# EAGLE design MM8I Mk2 (EAGLE 9.5.2)

## Sheet 1 of 3
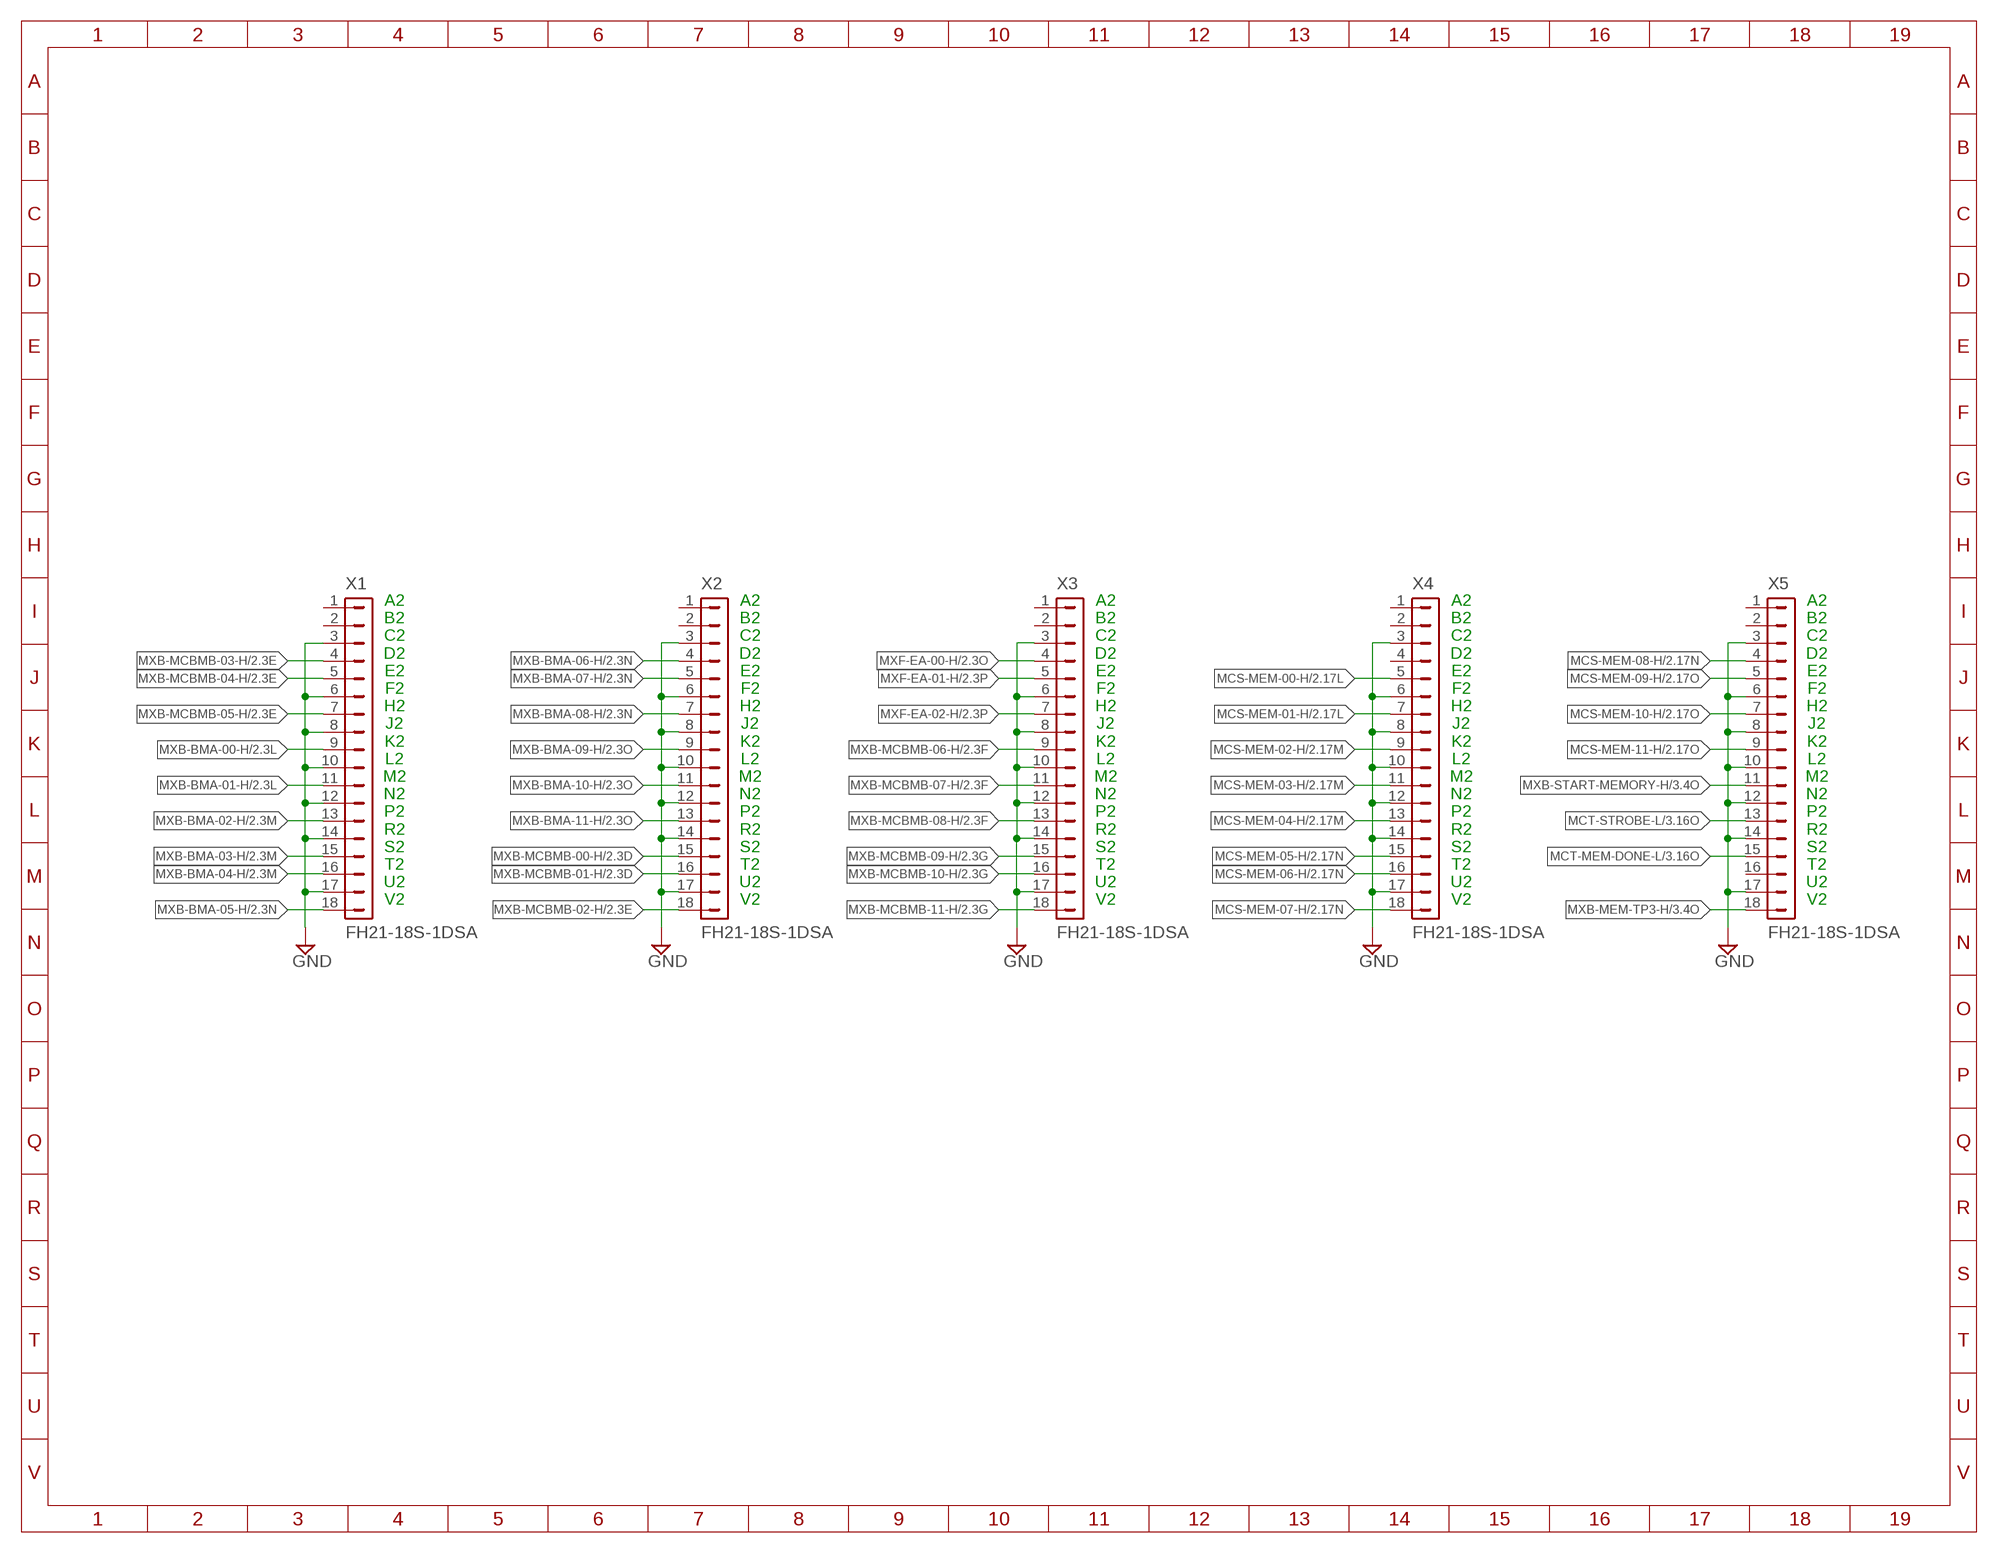
[diagram p0: schematic, sheet 1]

### Parts
X1  FH21-18S-1DSA  [FH21-18S-1DSA]
X2  FH21-18S-1DSA  [FH21-18S-1DSA]
X3  FH21-18S-1DSA  [FH21-18S-1DSA]
X4  FH21-18S-1DSA  [FH21-18S-1DSA]
X5  FH21-18S-1DSA  [FH21-18S-1DSA]

### Nets
GND: X1.3 X1.6 X1.8 X1.10 X1.12 X1.14 X1.17 X2.3 X2.6 X2.8 X2.10 X2.12 X2.14 X2.17 X3.3 X3.6 X3.8 X3.10 X3.12 X3.14 X3.17 X4.3 X4.6 X4.8 X4.10 X4.12 X4.14 X4.17 X5.3 X5.6 X5.8 X5.10 X5.12 X5.14 X5.17 ; also sheet 2,3
MCS-MEM-00-H: X4.5 ; also sheet 2
MCS-MEM-01-H: X4.7 ; also sheet 2
MCS-MEM-02-H: X4.9 ; also sheet 2
MCS-MEM-03-H: X4.11 ; also sheet 2
MCS-MEM-04-H: X4.13 ; also sheet 2
MCS-MEM-05-H: X4.15 ; also sheet 2
MCS-MEM-06-H: X4.16 ; also sheet 2
MCS-MEM-07-H: X4.18 ; also sheet 2
MCS-MEM-08-H: X5.4 ; also sheet 2
MCS-MEM-09-H: X5.5 ; also sheet 2
MCS-MEM-10-H: X5.7 ; also sheet 2
MCS-MEM-11-H: X5.9 ; also sheet 2
MCT-MEM-DONE-L: X5.15 ; also sheet 3
MCT-STROBE-L: X5.13 ; also sheet 3
MXB-BMA-00-H: X1.9 ; also sheet 2
MXB-BMA-01-H: X1.11 ; also sheet 2
MXB-BMA-02-H: X1.13 ; also sheet 2
MXB-BMA-03-H: X1.15 ; also sheet 2
MXB-BMA-04-H: X1.16 ; also sheet 2
MXB-BMA-05-H: X1.18 ; also sheet 2
MXB-BMA-06-H: X2.4 ; also sheet 2
MXB-BMA-07-H: X2.5 ; also sheet 2
MXB-BMA-08-H: X2.7 ; also sheet 2
MXB-BMA-09-H: X2.9 ; also sheet 2
MXB-BMA-10-H: X2.11 ; also sheet 2
MXB-BMA-11-H: X2.13 ; also sheet 2
MXB-MCBMB-00-H: X2.15 ; also sheet 2
MXB-MCBMB-01-H: X2.16 ; also sheet 2
MXB-MCBMB-02-H: X2.18 ; also sheet 2
MXB-MCBMB-03-H: X1.4 ; also sheet 2
MXB-MCBMB-04-H: X1.5 ; also sheet 2
MXB-MCBMB-05-H: X1.7 ; also sheet 2
MXB-MCBMB-06-H: X3.9 ; also sheet 2
MXB-MCBMB-07-H: X3.11 ; also sheet 2
MXB-MCBMB-08-H: X3.13 ; also sheet 2
MXB-MCBMB-09-H: X3.15 ; also sheet 2
MXB-MCBMB-10-H: X3.16 ; also sheet 2
MXB-MCBMB-11-H: X3.18 ; also sheet 2
MXB-MEM-TP3-H: X5.18 ; also sheet 3
MXB-START-MEMORY-H: X5.11 ; also sheet 3
MXF-EA-00-H: X3.4 ; also sheet 2
MXF-EA-01-H: X3.5 ; also sheet 2
MXF-EA-02-H: X3.7 ; also sheet 2
Unconnected: X1.1 X1.2 X2.1 X2.2 X3.1 X3.2 X4.1 X4.2 X4.4 X5.1 X5.2 X5.16

### Notes on the sheet
- A2
  B2
  C2
  D2
  E2
  F2
  H2
  J2
  K2
  L2
  M2
  N2
  P2
  R2
  S2
  T2
  U2
  V2
- A2
  B2
  C2
  D2
  E2
  F2
  H2
  J2
  K2
  L2
  M2
  N2
  P2
  R2
  S2
  T2
  U2
  V2
- A2
  B2
  C2
  D2
  E2
  F2
  H2
  J2
  K2
  L2
  M2
  N2
  P2
  R2
  S2
  T2
  U2
  V2
- A2
  B2
  C2
  D2
  E2
  F2
  H2
  J2
  K2
  L2
  M2
  N2
  P2
  R2
  S2
  T2
  U2
  V2
- A2
  B2
  C2
  D2
  E2
  F2
  H2
  J2
  K2
  L2
  M2
  N2
  P2
  R2
  S2
  T2
  U2
  V2

## Sheet 2 of 3
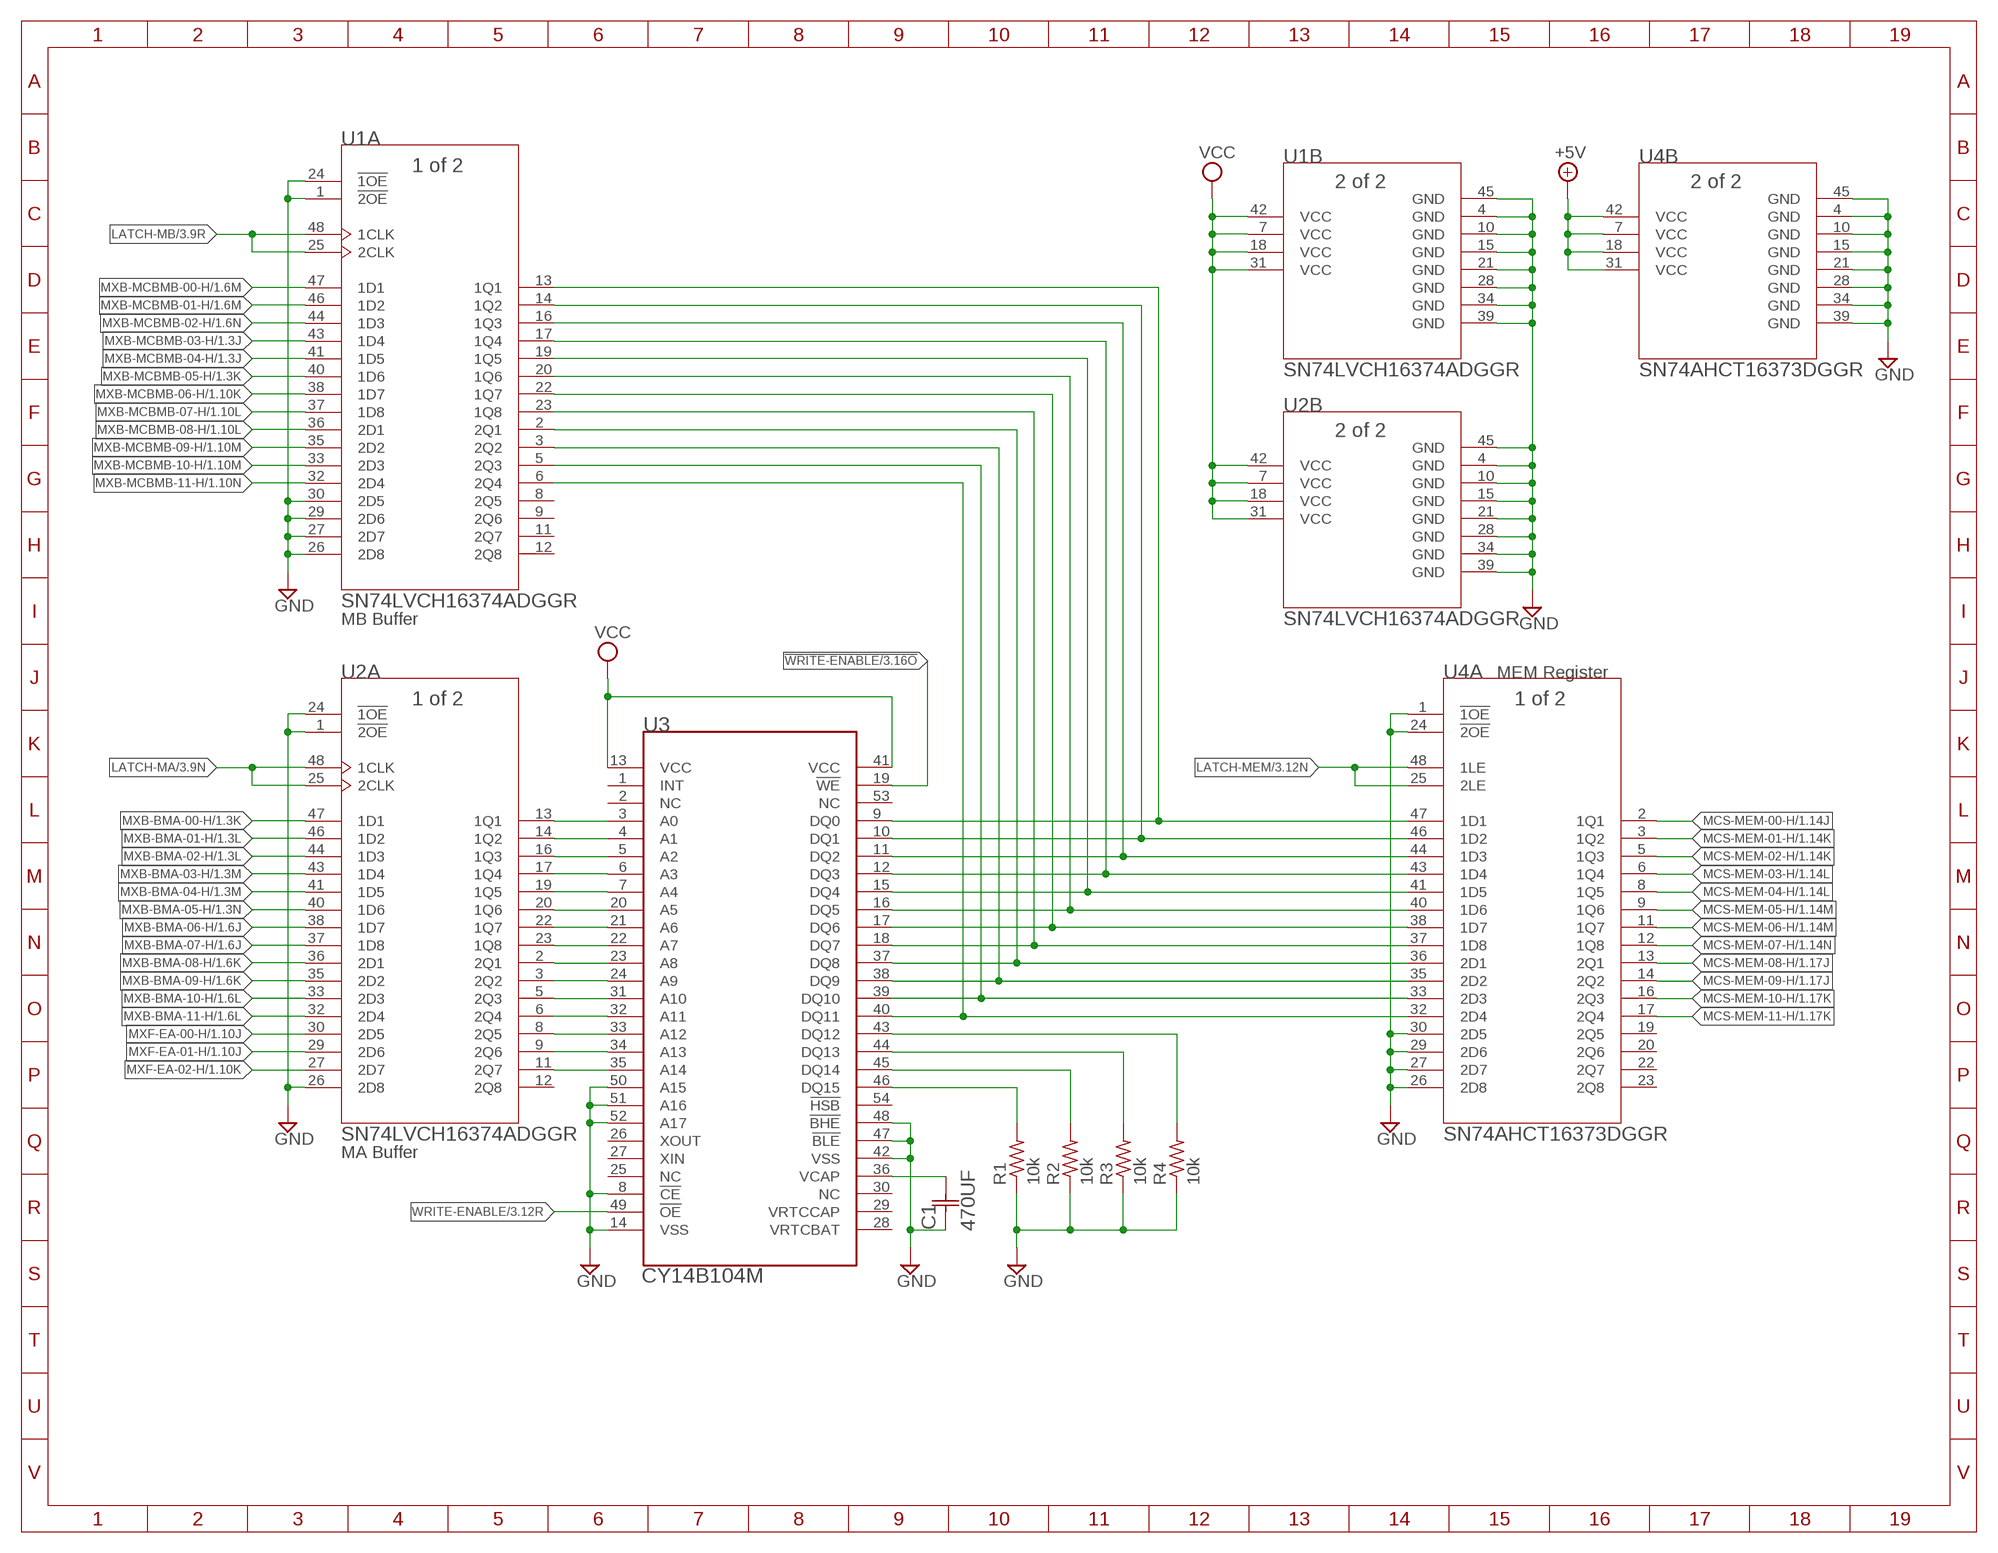
[diagram p1: schematic, sheet 2]

### Parts
C1  470UF  NOSE477M004R0100  [CAPCP7343X430N]
R1  10k  R-US_R1206  [R1206]
R2  10k  R-US_R1206  [R1206]
R3  10k  R-US_R1206  [R1206]
R4  10k  R-US_R1206  [R1206]
U1  SN74LVCH16374ADGGR  [DGG48]
U2  SN74LVCH16374ADGGR  [DGG48]
U3  CY14B104M  [TSOPII-54]
U4  SN74AHCT16373DGGR  [DGG48]

### Nets
!WRITE-ENABLE: U3.19(!WE) ; also sheet 3
+5V: U4.7(B:VCC) U4.18(B:VCC) U4.31(B:VCC) U4.42(B:VCC) ; also sheet 3
GND: C1.2(C2) R1.1 R2.1 R3.1 R4.1 U1.1(A:!2OE) U1.4(B:GND) U1.10(B:GND) U1.15(B:GND) U1.21(B:GND) U1.24(A:!1OE) U1.26(A:2D8) U1.27(A:2D7) U1.28(B:GND) U1.29(A:2D6) U1.30(A:2D5) U1.34(B:GND) U1.39(B:GND) U1.45(B:GND) U2.1(A:!2OE) U2.4(B:GND) U2.10(B:GND) U2.15(B:GND) U2.21(B:GND) U2.24(A:!1OE) U2.26(A:2D8) U2.28(B:GND) U2.34(B:GND) U2.39(B:GND) U2.45(B:GND) U3.8(!CE) U3.14(VSS) U3.42(VSS) U3.47(!BLE) U3.48(!BHE) U3.50(A15) U3.51(A16) U3.52(A17) U4.1(A:!1OE) U4.4(B:GND) U4.10(B:GND) U4.15(B:GND) U4.21(B:GND) U4.24(A:!2OE) U4.26(A:2D8) U4.27(A:2D7) U4.28(B:GND) U4.29(A:2D6) U4.30(A:2D5) U4.34(B:GND) U4.39(B:GND) U4.45(B:GND) ; also sheet 1,3
LATCH-MA: U2.25(A:2CLK) U2.48(A:1CLK) ; also sheet 3
LATCH-MB: U1.25(A:2CLK) U1.48(A:1CLK) ; also sheet 3
LATCH-MEM: U4.25(A:2LE) U4.48(A:1LE) ; also sheet 3
MCS-MEM-00-H: U4.2(A:1Q1) ; also sheet 1
MCS-MEM-01-H: U4.3(A:1Q2) ; also sheet 1
MCS-MEM-02-H: U4.5(A:1Q3) ; also sheet 1
MCS-MEM-03-H: U4.6(A:1Q4) ; also sheet 1
MCS-MEM-04-H: U4.8(A:1Q5) ; also sheet 1
MCS-MEM-05-H: U4.9(A:1Q6) ; also sheet 1
MCS-MEM-06-H: U4.11(A:1Q7) ; also sheet 1
MCS-MEM-07-H: U4.12(A:1Q8) ; also sheet 1
MCS-MEM-08-H: U4.13(A:2Q1) ; also sheet 1
MCS-MEM-09-H: U4.14(A:2Q2) ; also sheet 1
MCS-MEM-10-H: U4.16(A:2Q3) ; also sheet 1
MCS-MEM-11-H: U4.17(A:2Q4) ; also sheet 1
MXB-BMA-00-H: U2.47(A:1D1) ; also sheet 1
MXB-BMA-01-H: U2.46(A:1D2) ; also sheet 1
MXB-BMA-02-H: U2.44(A:1D3) ; also sheet 1
MXB-BMA-03-H: U2.43(A:1D4) ; also sheet 1
MXB-BMA-04-H: U2.41(A:1D5) ; also sheet 1
MXB-BMA-05-H: U2.40(A:1D6) ; also sheet 1
MXB-BMA-06-H: U2.38(A:1D7) ; also sheet 1
MXB-BMA-07-H: U2.37(A:1D8) ; also sheet 1
MXB-BMA-08-H: U2.36(A:2D1) ; also sheet 1
MXB-BMA-09-H: U2.35(A:2D2) ; also sheet 1
MXB-BMA-10-H: U2.33(A:2D3) ; also sheet 1
MXB-BMA-11-H: U2.32(A:2D4) ; also sheet 1
MXB-MCBMB-00-H: U1.47(A:1D1) ; also sheet 1
MXB-MCBMB-01-H: U1.46(A:1D2) ; also sheet 1
MXB-MCBMB-02-H: U1.44(A:1D3) ; also sheet 1
MXB-MCBMB-03-H: U1.43(A:1D4) ; also sheet 1
MXB-MCBMB-04-H: U1.41(A:1D5) ; also sheet 1
MXB-MCBMB-05-H: U1.40(A:1D6) ; also sheet 1
MXB-MCBMB-06-H: U1.38(A:1D7) ; also sheet 1
MXB-MCBMB-07-H: U1.37(A:1D8) ; also sheet 1
MXB-MCBMB-08-H: U1.36(A:2D1) ; also sheet 1
MXB-MCBMB-09-H: U1.35(A:2D2) ; also sheet 1
MXB-MCBMB-10-H: U1.33(A:2D3) ; also sheet 1
MXB-MCBMB-11-H: U1.32(A:2D4) ; also sheet 1
MXF-EA-00-H: U2.30(A:2D5) ; also sheet 1
MXF-EA-01-H: U2.29(A:2D6) ; also sheet 1
MXF-EA-02-H: U2.27(A:2D7) ; also sheet 1
N$1: C1.1(C1) U3.36(VCAP)
N$2: U1.13(A:1Q1) U3.9(DQ0) U4.47(A:1D1)
N$3: U1.14(A:1Q2) U3.10(DQ1) U4.46(A:1D2)
N$4: U1.16(A:1Q3) U3.11(DQ2) U4.44(A:1D3)
N$5: U1.17(A:1Q4) U3.12(DQ3) U4.43(A:1D4)
N$6: U1.19(A:1Q5) U3.15(DQ4) U4.41(A:1D5)
N$7: U1.20(A:1Q6) U3.16(DQ5) U4.40(A:1D6)
N$8: R4.2 U3.43(DQ12)
N$9: R1.2 U3.46(DQ15)
N$10: R2.2 U3.45(DQ14)
N$11: U1.22(A:1Q7) U3.17(DQ6) U4.38(A:1D7)
N$12: R3.2 U3.44(DQ13)
N$13: U1.23(A:1Q8) U3.18(DQ7) U4.37(A:1D8)
N$14: U1.2(A:2Q1) U3.37(DQ8) U4.36(A:2D1)
N$15: U1.3(A:2Q2) U3.38(DQ9) U4.35(A:2D2)
N$16: U1.5(A:2Q3) U3.39(DQ10) U4.33(A:2D3)
N$17: U1.6(A:2Q4) U3.40(DQ11) U4.32(A:2D4)
N$30: U2.2(A:2Q1) U3.23(A8)
N$31: U2.16(A:1Q3) U3.5(A2)
N$32: U2.13(A:1Q1) U3.3(A0)
N$33: U2.14(A:1Q2) U3.4(A1)
N$34: U2.17(A:1Q4) U3.6(A3)
N$36: U2.19(A:1Q5) U3.7(A4)
N$37: U2.20(A:1Q6) U3.20(A5)
N$38: U2.22(A:1Q7) U3.21(A6)
N$39: U2.23(A:1Q8) U3.22(A7)
N$40: U2.3(A:2Q2) U3.24(A9)
N$41: U2.5(A:2Q3) U3.31(A10)
N$42: U2.6(A:2Q4) U3.32(A11)
N$43: U2.8(A:2Q5) U3.33(A12)
N$44: U2.9(A:2Q6) U3.34(A13)
N$45: U2.11(A:2Q7) U3.35(A14)
VCC: U1.7(B:VCC) U1.18(B:VCC) U1.31(B:VCC) U1.42(B:VCC) U2.7(B:VCC) U2.18(B:VCC) U2.31(B:VCC) U2.42(B:VCC) U3.13(VCC) U3.41(VCC) ; also sheet 3
WRITE-ENABLE: U3.49(!OE) ; also sheet 3
Unconnected: U1.8(A:2Q5) U1.9(A:2Q6) U1.11(A:2Q7) U1.12(A:2Q8) U2.12(A:2Q8) U3.1(INT) U3.2(NC) U3.25(NC) U3.26(XOUT) U3.27(XIN) U3.28(VRTCBAT) U3.29(VRTCCAP) U3.30(NC) U3.53(NC) U3.54(!HSB) U4.19(A:2Q5) U4.20(A:2Q6) U4.22(A:2Q7) U4.23(A:2Q8)

### Notes on the sheet
- MB Buffer
- MEM Register
- MA Buffer

## Sheet 3 of 3
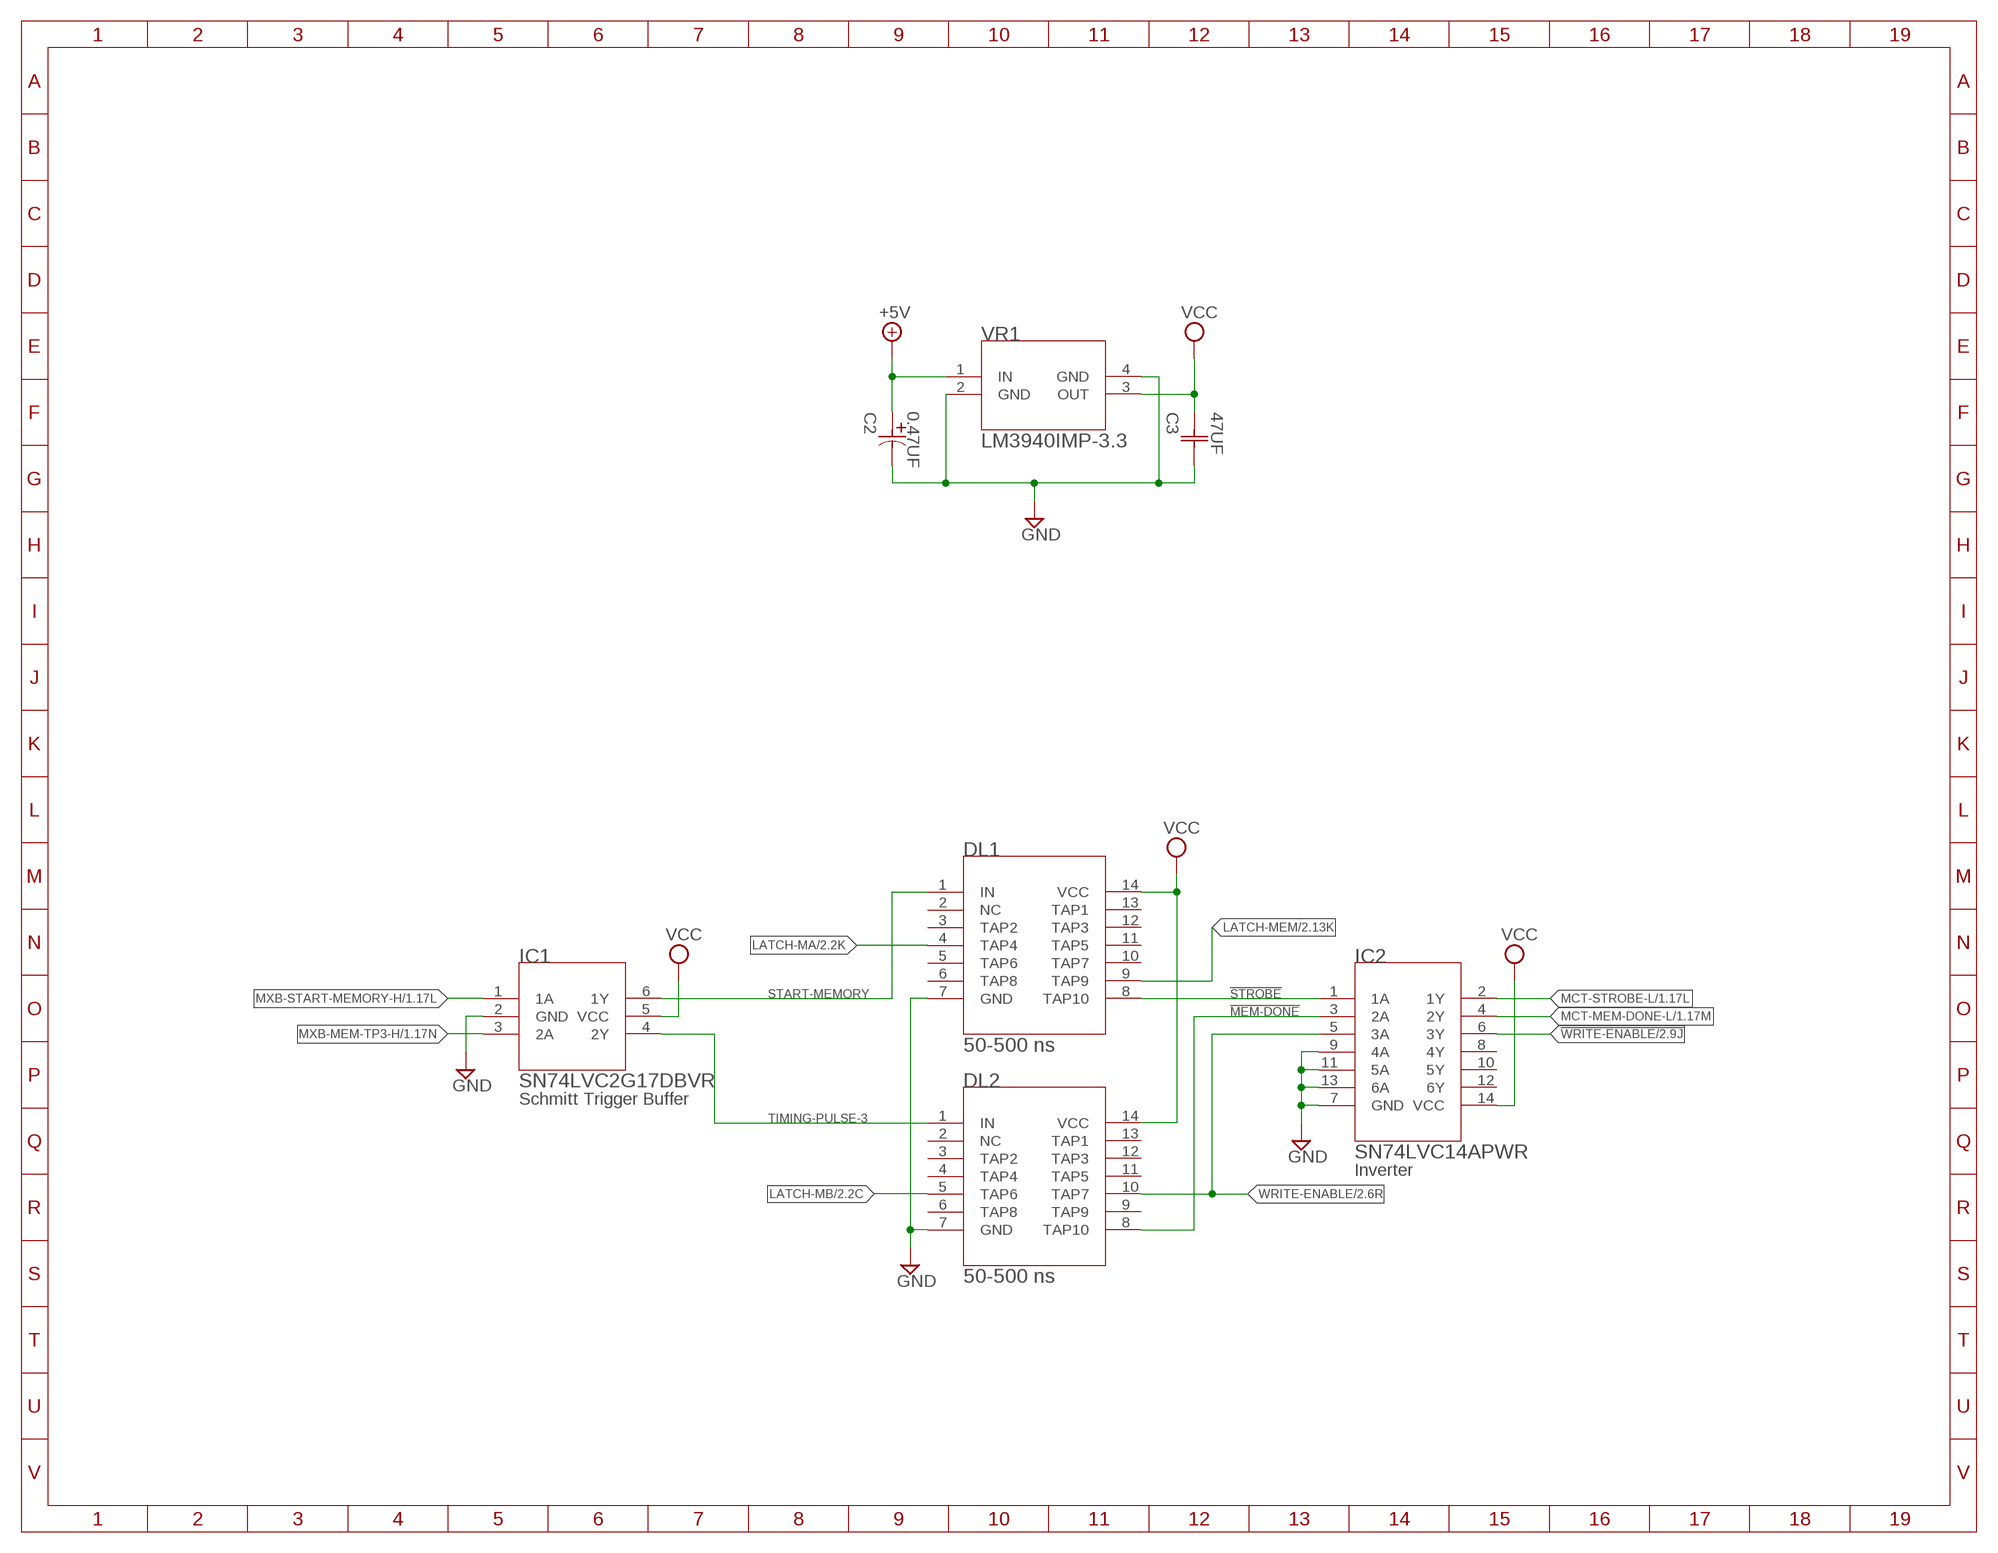
[diagram p2: schematic, sheet 3]

### Parts
C2  0.47UF  C0603C474K8PACTU  [CC0603N]
C3  47UF  NOJC476M010RWJ  [NOJC]
DL1  50-500 ns  DS1110LE-500+  [21-0066J_14]
DL2  50-500 ns  DS1110LE-500+  [21-0066J_14]
IC1  SN74LVC2G17DBVR  [DBV6]
IC2  SN74LVC14APWR  [PW14]
VR1  LM3940IMP-3.3  [MP04A]

### Nets
!MEM-DONE: DL2.8(TAP10) IC2.3(2A)
!STROBE: DL1.8(TAP10) IC2.1(1A)
!WRITE-ENABLE: IC2.6(3Y) ; also sheet 2
+5V: C2.1 VR1.1(IN) ; also sheet 2
GND: C2.2 C3.2(C2) DL1.7(GND) DL2.7(GND) IC1.2(GND) IC2.7(GND) IC2.9(4A) IC2.11(5A) IC2.13(6A) VR1.2(GND) VR1.4(GND) ; also sheet 1,2
LATCH-MA: DL1.4(TAP4) ; also sheet 2
LATCH-MB: DL2.5(TAP6) ; also sheet 2
LATCH-MEM: DL1.9(TAP9) ; also sheet 2
MCT-MEM-DONE-L: IC2.4(2Y) ; also sheet 1
MCT-STROBE-L: IC2.2(1Y) ; also sheet 1
MXB-MEM-TP3-H: IC1.3(2A) ; also sheet 1
MXB-START-MEMORY-H: IC1.1(1A) ; also sheet 1
START-MEMORY: DL1.1(IN) IC1.6(1Y)
TIMING-PULSE-3: DL2.1(IN) IC1.4(2Y)
VCC: C3.1(C1) DL1.14(VCC) DL2.14(VCC) IC1.5(VCC) IC2.14(VCC) VR1.3(OUT) ; also sheet 2
WRITE-ENABLE: DL2.10(TAP7) IC2.5(3A) ; also sheet 2
Unconnected: DL1.2(NC) DL1.3(TAP2) DL1.5(TAP6) DL1.6(TAP8) DL1.10(TAP7) DL1.11(TAP5) DL1.12(TAP3) DL1.13(TAP1) DL2.2(NC) DL2.3(TAP2) DL2.4(TAP4) DL2.6(TAP8) DL2.9(TAP9) DL2.11(TAP5) DL2.12(TAP3) DL2.13(TAP1) IC2.8(4Y) IC2.10(5Y) IC2.12(6Y)

### Notes on the sheet
- Schmitt Trigger Buffer
- Inverter

## Library data of the parts
C1 = AVX_By_element14_Batch_1:NOSE477M004R0100: CAP NIOB OXIDE , 2917; CAPACITANCETOLERANCE: ±20%; MPN: NOSE477M004R0100; OC_FARNELL: -; OC_NEWARK: 53J7410; SUPPLIER: AVX; VOLTAGERATING: 4V
C2 = MM24I:C0603C474K8PACTU: CAP, MLPC, 0603; BUILT_BY: EMA_UL_Team; MANUFACTURER_PART_NUMBER: C0603C474K8PACTU; VENDOR: Kemet
C3 = MM24I:NOJC476M010RWJ: CAP, NIOB OXIDE, 2312; BUILT_BY: EMA_UL_Team; MANUFACTURER_PART_NUMBER: NOJC476M010RWJ; VENDOR: AVX Corporation
DL1 DL2 = MM24I:DS1110LE-500+; BUILT_BY: EMA_UL_Team; MANUFACTURER_PART_NUMBER: DS1110LE-100+; VENDOR: Maxim Integrated Products
IC1 = MM24I:SN74LVC2G17DBVR; BUILT_BY: EMA_UL_Team; MANUFACTURER: Texas Instruments; MANUFACTURER_PART_NUMBER: SN74LVC2G17DBVR; VENDOR: Texas Instruments
IC2 = MM24I:SN74LVC14APWR; BUILT_BY: EMA_UL_Team; MANUFACTURER: Texas Instruments; MANUFACTURER_PART_NUMBER: SN74LVC14APWR; VENDOR: Texas Instruments
R1-R4 = rcl:R-US_: RESISTOR, American symbol; SPICEPREFIX: R
U1 U2 = MM24I:SN74LVCH16374ADGGR; BUILT_BY: EMA_UL_Team; MANUFACTURER_PART_NUMBER: SN74LVCH16374ADGGR; VENDOR: Texas Instruments
U3 = MM24I:CY14B104M: Cypress CY14B104M 4-Mbit (256 K × 16) nvSRAM with Real Time Clock https://www.cypress.com/file/43036/download
U4 = MM24I:SN74AHCT16373DGGR; BUILT_BY: EMA_UL_Team; MANUFACTURER: Texas Instruments; MANUFACTURER_PART_NUMBER: SN74AHCT16373DGGR; VENDOR: Texas Instruments
VR1 = MM24I:LM3940IMP-3.3; BUILT_BY: EMA_UL_Team; MANUFACTURER_PART_NUMBER: LM3940IMP-3.3/NOPB; VENDOR: Texas Instruments
X1-X5 = con-hirose:FH21-18S-1DSA: FPC CONNECTOR Source: con-hirose.lbr from Bob Starr <rtzaudio@mindspring.com>; OC_FARNELL: unknown; OC_NEWARK: unknown

## Board
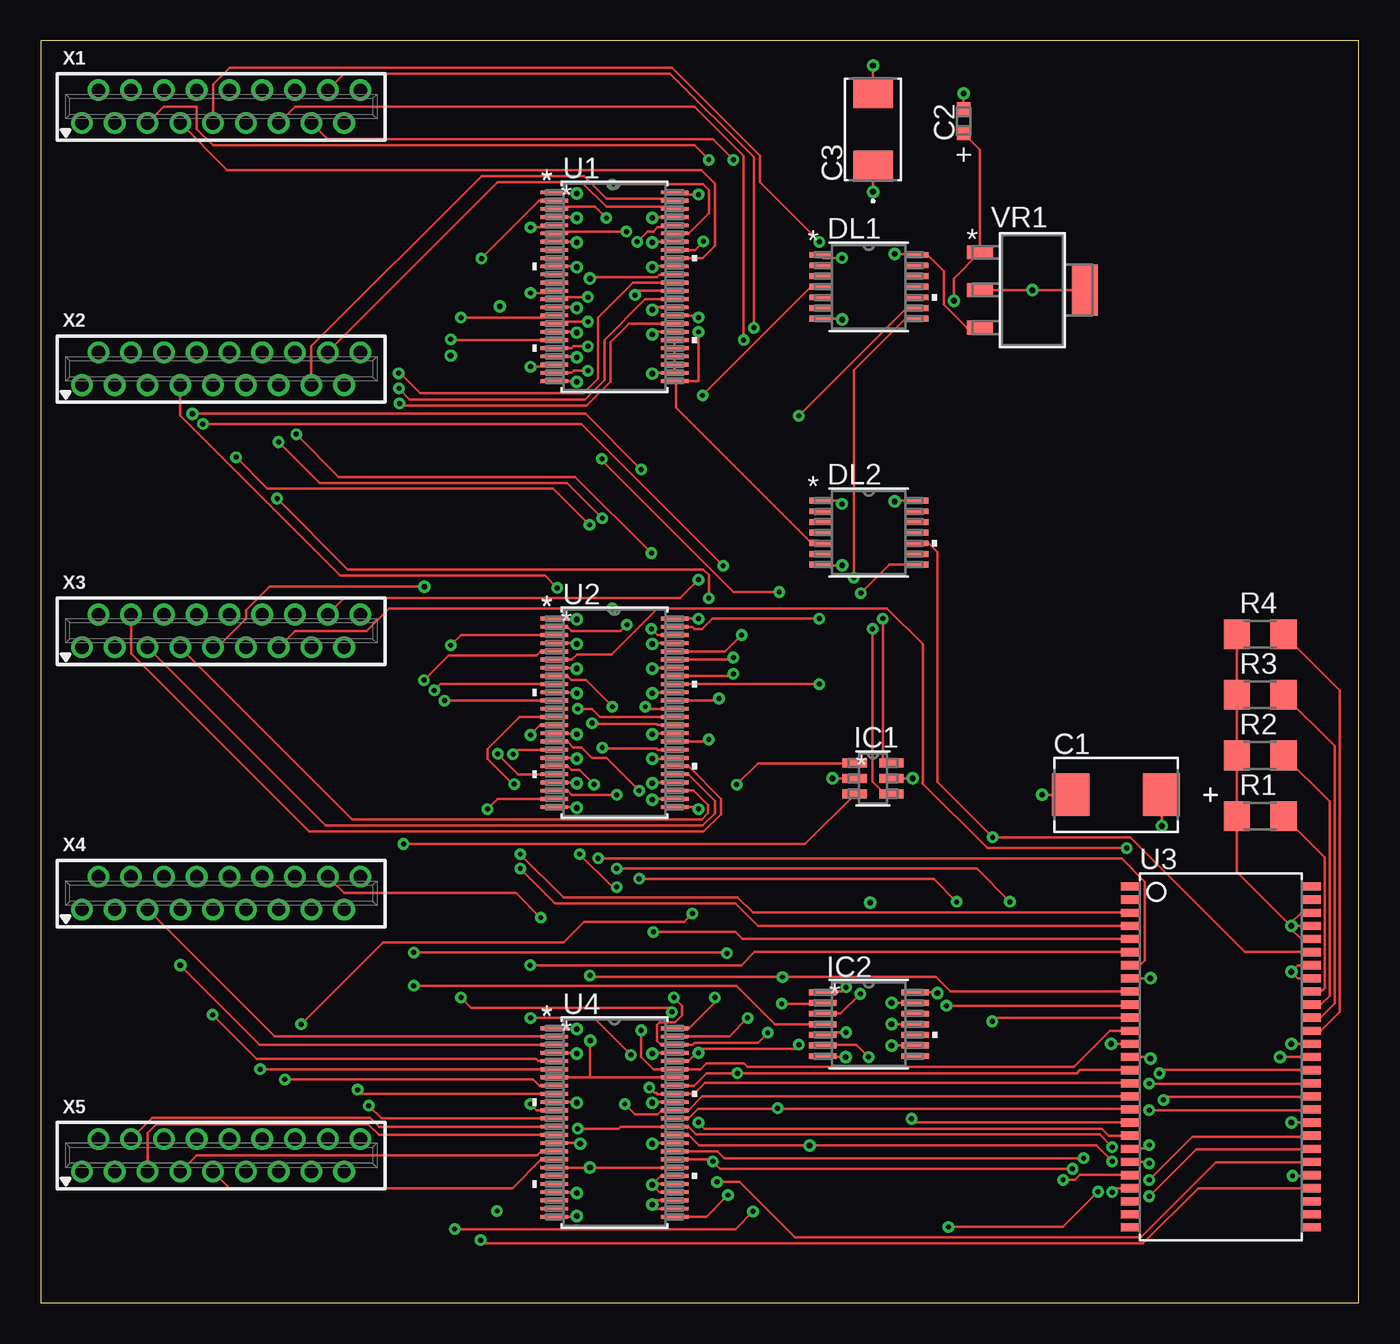
[diagram p3: board, top side]
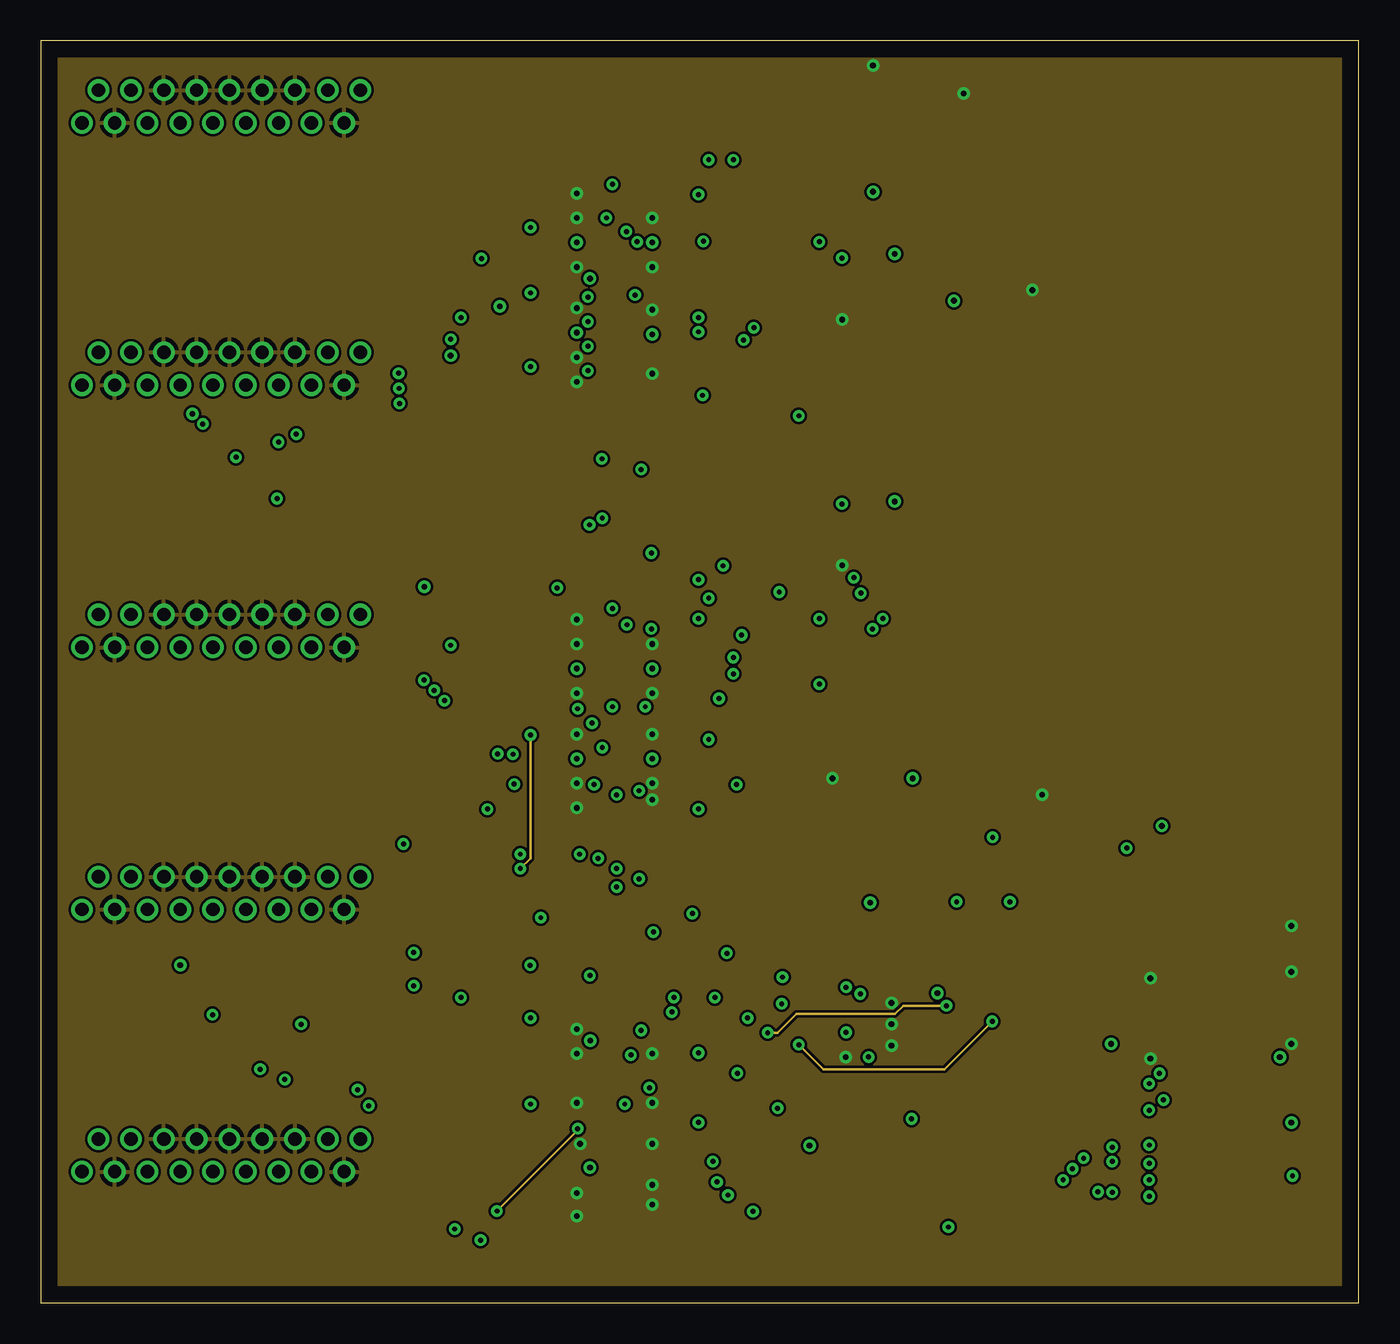
[diagram p4: board, inner layer Layer2]
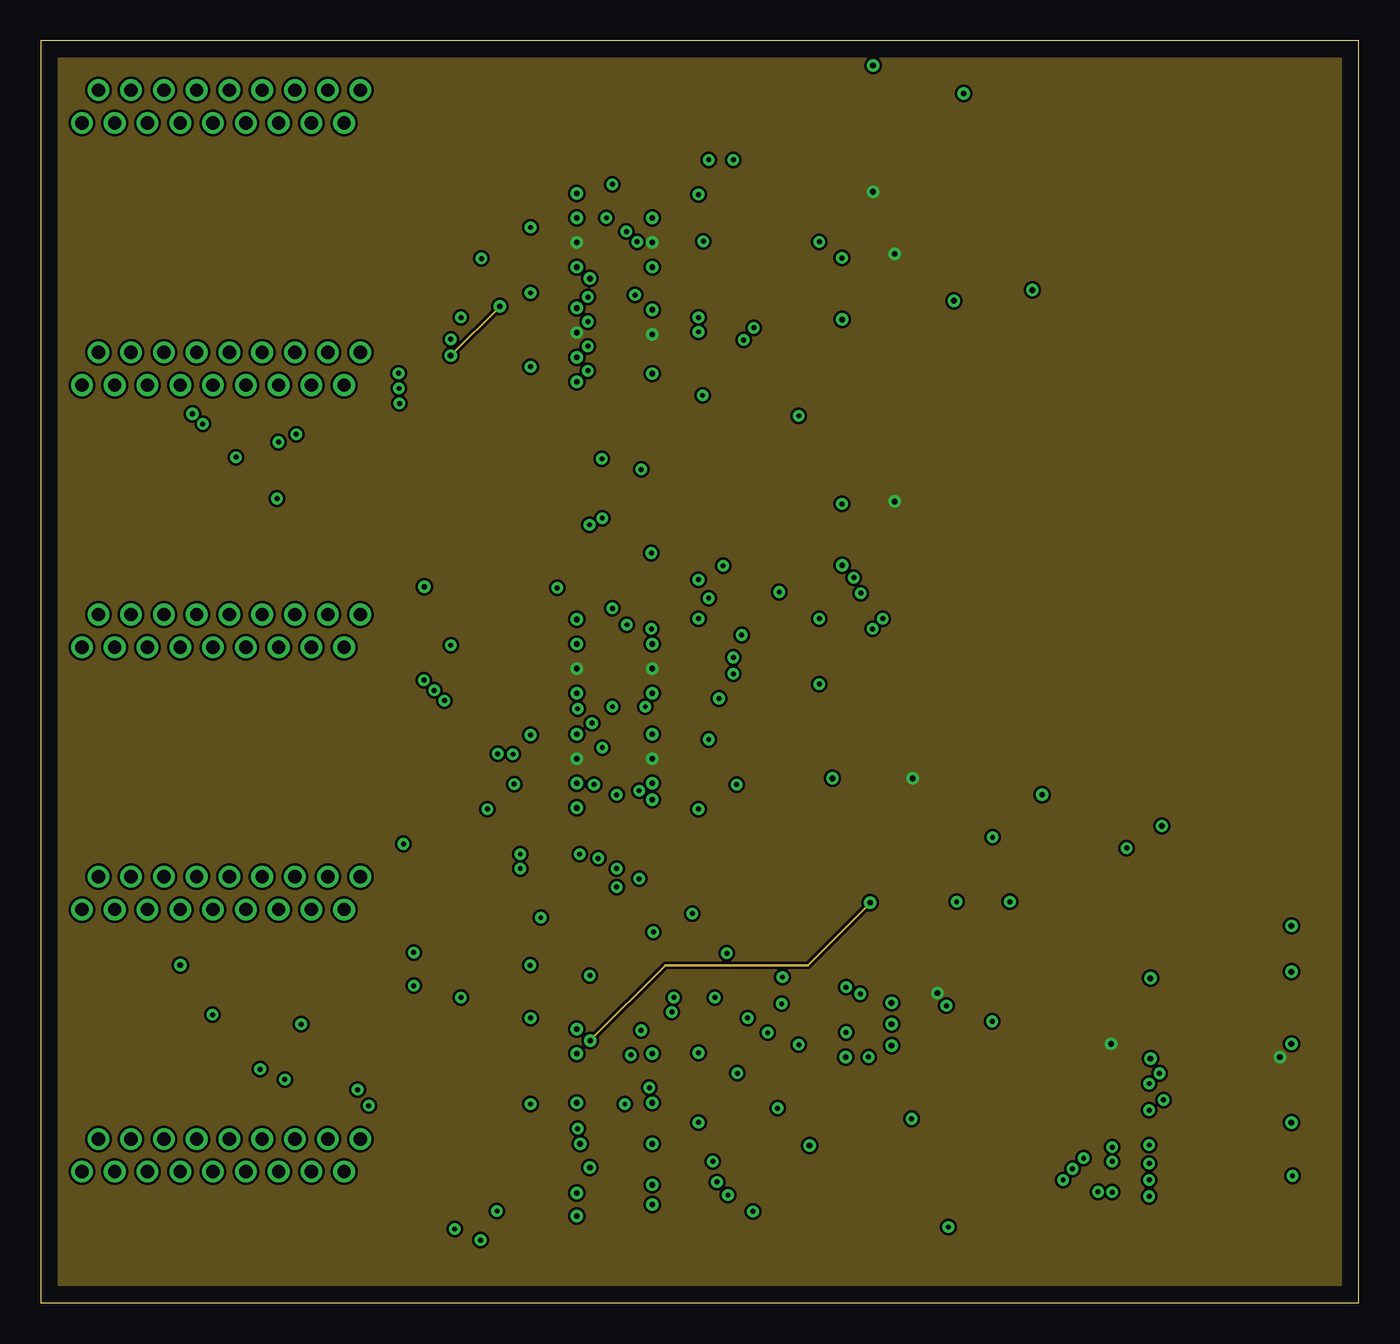
[diagram p5: board, inner layer Layer3]
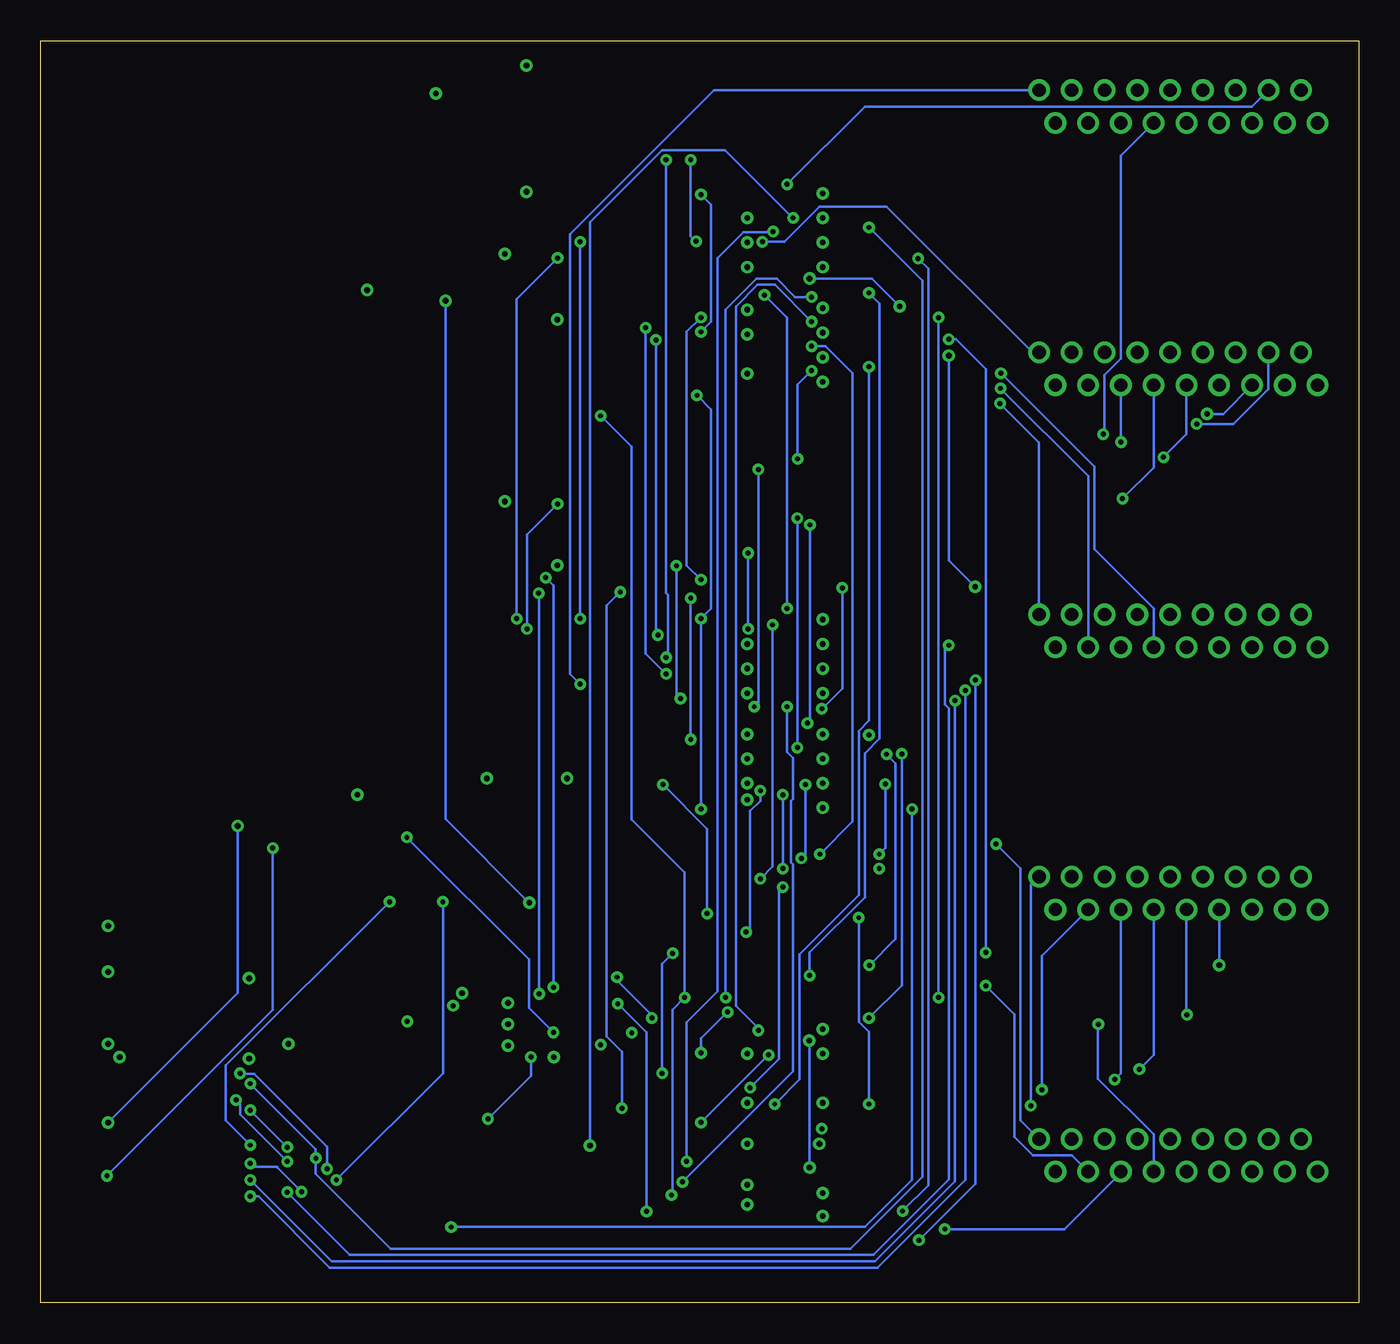
[diagram p6: board, bottom side, seen from below]

Size 80.4 x 77 mm. Coordinates in mm from the lower left corner, seen from the top.
Outline: 0,0 80.4,0 80.4,77 0,77 0,0
Copper layers (1+2*15+16): Top 0.035mm / dielectric 0.11mm / Layer2 0.035mm / dielectric 0.73mm / Layer3 0.035mm / dielectric 0.11mm / Bottom 0.035mm
Design rules "default *": minimum track width 6mil, minimum drill 0.3mm, track to track 6mil, track to pad 6mil, pad to pad 6mil, via to via 6mil, smd to smd 6mil, copper to edge 40mil, drill to drill 6mil, minimum pad ring 10mil, minimum via ring 8mil, stop-mask expansion 4mil, vias tented up to drill 0mil, thermal gap 10mil

### Footprints (pad centres in the part's own frame; a part is rotated, then mirrored left to right if it is on the bottom)
CAPCP7343X430N = smd 2.261 x 2.591: 1 -2.769,0; 2 2.769,0
CC0603N = smd 0.864 x 0.813: 1 -0.724,0; 2 0.724,0
NOJC = smd 1.88 x 2.413: 1 -2.235,0; 2 2.235,0
21-0066J_14 = smd 1.422 x 0.356: 1 -2.921,1.95; 2 -2.921,1.3; 3 -2.921,0.65; 4 -2.921,0; 5 -2.921,-0.65; 6 -2.921,-1.3; 7 -2.921,-1.95; 8 2.921,-1.95; 9 2.921,-1.3; 10 2.921,-0.65; 11 2.921,0; 12 2.921,0.65; 13 2.921,1.3; 14 2.921,1.95
DBV6 = smd 1.473 x 0.559: 1 -1.118,0.95; 2 -1.118,0; 3 -1.118,-0.95; 4 1.118,-0.95; 5 1.118,0; 6 1.118,0.95
PW14 = smd 1.676 x 0.356: 1 -2.819,1.95; 2 -2.819,1.3; 3 -2.819,0.65; 4 -2.819,0; 5 -2.819,-0.65; 6 -2.819,-1.3; 7 -2.819,-1.95; 8 2.819,-1.95; 9 2.819,-1.3; 10 2.819,-0.65; 11 2.819,0; 12 2.819,0.65; 13 2.819,1.3; 14 2.819,1.95
R1206 = smd 1.6 x 1.803: 1 -1.422,0; 2 1.422,0
DGG48 = smd 1.676 x 0.229: 1 -3.67,5.75; 2 -3.67,5.25; 3 -3.67,4.75; 4 -3.67,4.25; 5 -3.67,3.75; 6 -3.67,3.25; 7 -3.67,2.75; 8 -3.67,2.25; 9 -3.67,1.75; 10 -3.67,1.25; 11 -3.67,0.75; 12 -3.67,0.25; 13 -3.67,-0.25; 14 -3.67,-0.75; 15 -3.67,-1.25; 16 -3.67,-1.75; 17 -3.67,-2.25; 18 -3.67,-2.75; 19 -3.67,-3.25; 20 -3.67,-3.75; 21 -3.67,-4.25; 22 -3.67,-4.75; 23 -3.67,-5.25; 24 -3.67,-5.75; 25 3.67,-5.75; 26 3.67,-5.25; 27 3.67,-4.75; 28 3.67,-4.25; 29 3.67,-3.75; 30 3.67,-3.25; 31 3.67,-2.75; 32 3.67,-2.25; 33 3.67,-1.75; 34 3.67,-1.25; 35 3.67,-0.75; 36 3.67,-0.25; 37 3.67,0.25; 38 3.67,0.75; 39 3.67,1.25; 40 3.67,1.75; 41 3.67,2.25; 42 3.67,2.75; 43 3.67,3.25; 44 3.67,3.75; 45 3.67,4.25; 46 3.67,4.75; 47 3.67,5.25; 48 3.67,5.75
TSOPII-54 = smd 0.5 x 1.2: 1 -10.4,-5.502; 2 -9.6,-5.502; 3 -8.8,-5.502; 4 -8,-5.502; 5 -7.2,-5.502; 6 -6.4,-5.502; 7 -5.6,-5.502; 8 -4.8,-5.502; 9 -4,-5.502; 10 -3.2,-5.502; 11 -2.4,-5.502; 12 -1.6,-5.502; 13 -0.8,-5.502; 14 0,-5.502; 15 0.8,-5.502; 16 1.6,-5.502; 17 2.4,-5.502; 18 3.2,-5.502; 19 4,-5.502; 20 4.8,-5.502; 21 5.6,-5.502; 22 6.4,-5.502; 23 7.2,-5.502; 24 8,-5.502; 25 8.8,-5.502; 26 9.6,-5.502; 27 10.4,-5.502; 28 10.4,5.502; 29 9.6,5.502; 30 8.8,5.502; 31 8,5.502; 32 7.2,5.502; 33 6.4,5.502; 34 5.6,5.502; 35 4.8,5.502; 36 4,5.502; 37 3.2,5.502; 38 2.4,5.502; 39 1.6,5.502; 40 0.8,5.502; 41 0,5.502; 42 -0.8,5.502; 43 -1.6,5.502; 44 -2.4,5.502; 45 -3.2,5.502; 46 -4,5.502; 47 -4.8,5.502; 48 -5.6,5.502; 49 -6.4,5.502; 50 -7.2,5.502; 51 -8,5.502; 52 -8.8,5.502; 53 -9.6,5.502; 54 -10.4,5.502
MP04A = smd 1.6 x 0.838: 1 -3.2,2.3; 2 -3.2,0; 3 -3.2,-2.3 | smd 1.6 x 3.099: 4 3.2,0
FH21-18S-1DSA = drill 0.813: 1 -8.5,-1; 2 -7.5,1; 3 -6.5,-1; 4 -5.5,1; 5 -4.5,-1; 6 -3.5,1; 7 -2.5,-1; 8 -1.5,1; 9 -0.5,-1; 10 0.5,1; 11 1.5,-1; 12 2.5,1; 13 3.5,-1; 14 4.5,1; 15 5.5,-1; 16 6.5,1; 17 7.5,-1; 18 8.5,1

### Placement (x,y rotation side)
C1  65.6,31 180 top
C2  56.3,72.1 90 top
C3  50.77,71.6 90 top
DL1  50.51,62 0 top
DL2  50.51,47 0 top
IC1  50.77,32 0 top
IC2  50.51,17 0 top
R1  74.4,29.7 0 top
R2  74.4,33.4 0 top
R3  74.4,37.1 0 top
R4  74.4,40.8 0 top
U1  35,62 0 top
U2  35,36 0 top
U3  72,15 270 top
U4  35,11 0 top
VR1  60.5,61.8 0 top
X1  11,73 0 top
X2  11,57 0 top
X3  11,41 0 top
X4  11,25 0 top
X5  11,9 0 top

### Tracks (layer width: path | path; a pad name or v marks a point on that pad's centre or on a via)
!MEM-DONE  (via drill 0.3)
  Top 0.152: v50,18.85 48.8,17.65 IC2.3 | DL2.8 51.77,45.05 v50.02,43.3
  Bottom 0.152: v50.02,43.3 50,43.27 v50,18.85
!STROBE  (via drill 0.3)
  Top 0.152: v49.12,19.25 48.88,19 47.75,19 IC2.1 | DL1.8 52.75,60.05 49.6,56.9 v49.6,44.25
  Bottom 0.152: v49.6,44.25 49.12,43.77 v49.12,19.25
!WRITE-ENABLE  (via drill 0.3)
  Top 0.152: v53.12,11.22 53.34,11 U3.19 | v50.5,15 49.77,15.72 47.72,15.72 IC2.6
  Bottom 0.152: v53.12,11.22 50.5,13.85 v50.5,15
+5V  (via drill 0.35)
  Top 0.152: U4.31 v33.5,8.25 U4.18 | U4.42 33.5,13.75 | 33.5,13.75 U4.7 | C2.1 57.3,70.38 VR1.1 55.71,62.51 v55.71,61.15 | v33.52,16 33.52,13.77 33.5,13.75
  Layer3 0.152: v50.61,24.42 46.79,20.6 38.12,20.6 v33.52,16
  Bottom 0.152: v55.71,61.15 55.71,29.52 v50.61,24.42 | v33.52,16 33.52,8.27 v33.5,8.25
GND  (via drill 0.35)
  Top 0.152: U2.24 32.65,30.25 v32.7,30.2 | U2.1 32.65,41.75 v32.7,41.7 | U2.4 32.65,40.25 v32.7,40.2 | U2.10 32.65,37.25 v32.7,37.2 | U2.15 32.65,34.75 v32.7,34.7 | U2.21 32.65,31.75 v32.7,31.7 | v32.7,6.7 32.65,6.75 U4.21 | U4.24 32.65,5.25 v32.7,5.3 | U4.29 37.35,7.25 v37.3,7.2 | U4.28 37.75,6.75 v37.3,7.2 | U4.26 37.55,5.75 v37.3,6 37.55,6.25 U4.27 | U4.30 37.85,7.75 v37.3,7.2 | U4.34 37.35,9.75 v37.3,9.7 | U4.39 37.35,12.25 v37.3,12.2 | U4.45 37.35,15.25 v37.3,15.2 | U2.45 37.35,40.25 v37.3,40.2 | U2.39 37.35,37.25 v37.3,37.2 | U2.34 37.35,34.75 v37.3,34.7 | U2.28 37.35,31.75 v37.3,31.7 | U2.26 37.35,30.75 v37.3,30.7 | U4.15 32.85,9.75 v32.9,9.7 | U4.10 32.65,12.25 v32.7,12.2 | U4.4 32.65,15.25 v32.7,15.2 | U4.1 32.65,16.75 v32.7,16.7 | v32.7,67.7 31.38,67.7 U1.1 | U1.4 32.65,66.25 v32.7,66.2 | U1.10 32.65,63.25 v32.7,63.2 | U1.15 32.65,60.75 v32.7,60.7 | U1.45 37.35,66.25 v37.3,66.2 | U1.39 37.35,63.25 v37.3,63.2 | U1.34 37.45,60.75 v37.3,60.6 | U1.21 32.65,57.75 v32.7,57.7 | U1.24 32.65,56.25 v32.7,56.2 | U3.51 v76.3,23 | 76.7,23 v76.3,23 | U3.47 76.7,19.8 v76.3,20.2 76.7,20.6 U3.48 | U3.50 76.9,22.2 76.3,22.8 v76.3,23 | U3.52 76.9,23.8 76.3,23.2 v76.3,23 | v76.3,15.8 U3.42 | U3.14 67.6,15 v67.7,14.9 | U3.8 v67.7,19.8 | C2.2 v56.3,73.8 | DL1.7 48.85,60.05 v48.9,60 | v48.9,45 47.64,45 DL2.7 | IC1.2 v48.3,32 | v49.1,15 47.74,15 IC2.7 | v50.77,75.5 C3.2 | IC2.9 v51.9,15.7 | IC2.13 v51.9,18.3 | IC2.11 v51.9,17 | v61.1,31 C1.2 | VR1.2 v60.5,61.8 VR1.4 | U1.30 U1.29 U1.28 U1.27 U1.26 37.35,56.75 v37.3,56.7 | R4.1 R3.1 R2.1 R1.1 72.98,26.3 76.28,23 v76.3,23
  pour Layer2: 0,77 0,0 80.4,0 80.4,77
LATCH-MA  (via drill 0.3)
  Top 0.152: DL1.4 47,62 v40.38,55.38 | U2.48 v40.12,41.75 | v40.12,30.12 40,30.25 U2.25
  Bottom 0.152: v40.38,55.38 39.5,54.5 39.5,42.38 v40.12,41.75 v40.12,30.12
LATCH-MB  (via drill 0.3)
  Top 0.152: 38.75,56.25 38.75,54.62 46.88,46.5 47.38,46.5 47.5,46.38 DL2.5 | v40.12,67.62 38.88,67.62 38.75,67.75 U1.48 | v40.12,59.25 40.12,56.25 38.75,56.25 | 38.75,56.25 U1.25
  Bottom 0.152: v40.12,67.62 39.5,67 39.5,59.88 v40.12,59.25
LATCH-MEM  (via drill 0.3)
  Top 0.152: DL1.9 52.83,60.7 v46.25,54.12 | v41.12,18.62 41.12,18.32 39.55,16.75 U4.48 | U4.25 40.6,5.25 v41.93,6.58
  Bottom 0.152: v46.25,54.12 44.38,52.25 44.38,29.5 41.12,26.25 v41.12,18.62 41.88,17.88 41.88,6.62 v41.93,6.58
MCS-MEM-00-H
  Top 0.152: U4.2 14.25,16.25 X4.5
MCS-MEM-01-H  (via drill 0.35)
  Top 0.152: U4.3 15.3,15.75 13.38,15.75 13.35,15.75 v8.5,20.6
  Bottom 0.152: X4.7 v8.5,20.6
MCS-MEM-02-H  (via drill 0.3)
  Top 0.152: v10.47,17.57 13.17,14.88 30.21,14.88 30.33,14.75 U4.5
  Bottom 0.152: v10.47,17.57 10.5,17.6 X4.9
MCS-MEM-03-H  (via drill 0.3)
  Top 0.152: v13.38,14.25 U4.6
  Bottom 0.152: v13.38,14.25 12.5,15.12 X4.11
MCS-MEM-04-H  (via drill 0.3)
  Top 0.152: v14.88,13.62 14.9,13.65 30.03,13.65 30.43,13.25 U4.8
  Bottom 0.152: v14.88,13.62 14.5,14 X4.13
MCS-MEM-05-H  (via drill 0.3)
  Top 0.152: v19.33,13 19.58,12.75 U4.9
  Bottom 0.152: v19.33,13 19.33,21.18 16.53,23.98 16.52,23.98 X4.15
MCS-MEM-06-H  (via drill 0.3)
  Top 0.152: U4.11 30.25,11.75 v29.88,12.12 | v30.5,23.5 29,25 18.5,25 X4.16
  Bottom 0.152: v29.88,12.12 29.88,16.52 30.5,17.15 v30.5,23.5
MCS-MEM-07-H  (via drill 0.3)
  Top 0.152: U4.12 20.78,11.25 v20,12.03
  Bottom 0.152: v20,12.03 20,25.5 X4.18
MCS-MEM-08-H
  Top 0.152: U4.13 20.62,10.75 20.1,11.28 6.77,11.28 X5.4
MCS-MEM-09-H
  Top 0.152: U4.14 20.62,10.25 19.98,10.9 7.02,10.9 6.5,10.38 X5.5
MCS-MEM-10-H
  Top 0.152: U4.16 30.53,9.25 30.28,9 9.5,9 X5.7
MCS-MEM-11-H
  Top 0.152: U4.17 30.53,8.75 28.78,7 11.5,7 X5.9
MCT-MEM-DONE-L  (via drill 0.3)
  Top 0.152: IC2.4 44.8,17 42.45,19.35 v22.75,19.35
  Bottom 0.152: v22.75,19.35 21,17.6 21,10.12 19.88,9 17.5,9 X5.15
MCT-STROBE-L  (via drill 0.3)
  Top 0.152: v45.2,18.25 47.62,18.25 IC2.2 | v43.45,5.58 42.38,4.5 v25.25,4.5
  Bottom 0.152: v45.2,18.25 43.45,16.5 v43.45,5.58 | X5.13 14.5,7.94 17.94,4.5 v25.25,4.5
MXB-BMA-00-H  (via drill 0.3)
  Top 0.152: v47.5,41.75 40.98,41.75 40.35,41.12 39.88,41.12 39.75,41.25 U2.47 | v47.5,64.75 43.88,68.38 43.88,70 38.5,75.38 11.5,75.38 10.5,74.38 X1.9
  Bottom 0.152: v47.5,64.75 v47.5,41.75
MXB-BMA-01-H  (via drill 0.3)
  Top 0.152: U2.46 37.62,40.75 v37.25,41.12 | v37.25,45.75 32.6,50.4 18.18,50.4 v15.57,53
  Bottom 0.152: v37.25,45.75 v37.25,41.12 | v15.57,53 15.5,53.08 15.5,56.62 14.5,57.62 14.5,70 X1.11
MXB-BMA-02-H  (via drill 0.3)
  Top 0.152: U2.44 41.75,39.75 v42.75,40.75 | v42.88,58.75 42.88,70 39.88,73 15.5,73 X1.13
  Bottom 0.152: v42.75,40.75 42.88,40.88 v42.88,58.75
MXB-BMA-03-H  (via drill 0.3)
  Top 0.152: v42.25,39.38 42.12,39.25 U2.43 | v42.25,69.75 41,71 17.5,71 X1.15
  Bottom 0.152: v42.25,39.38 42.12,39.5 42.12,43.2 42.25,43.33 v42.25,69.75
MXB-BMA-04-H  (via drill 0.3)
  Top 0.152: v42.25,38.38 42.12,38.25 U2.41 | X1.16 18.5,75 38.4,75 43.5,69.9 v43.5,59.5
  Bottom 0.152: v42.25,38.38 43.5,39.62 v43.5,59.5
MXB-BMA-05-H  (via drill 0.3)
  Top 0.152: v47.5,37.75 U2.40
  Bottom 0.152: v47.5,37.75 48.12,38.38 48.12,65.2 39.33,74 X1.18
MXB-BMA-06-H  (via drill 0.3)
  Top 0.152: v41.38,36.88 41.25,36.75 U2.38 | v41.62,44.98 32.98,53.62 v9.88,53.62
  Bottom 0.152: v41.38,36.88 41.62,37.12 v41.62,44.98 | v9.88,53.62 9.86,53.61 7.63,53.61 5.5,55.74 X2.4
MXB-BMA-07-H  (via drill 0.3, 0.35)
  Top 0.152: v36.88,36.38 37,36.25 U2.37 | v36.62,50.85 33.23,54.25 v9.25,54.25 v9.24,54.24
  Bottom 0.152: v36.88,36.38 36.62,36.62 v36.62,50.85 | X2.5 8.26,54.24 v9.24,54.24
MXB-BMA-08-H  (via drill 0.3)
  Top 0.152: U2.36 34.12,35.75 33.62,36.25 v32.75,36.25 | v31.5,43.62 30.75,44.38 18.25,44.38 8.5,54.12 X2.7
  Bottom 0.152: v32.75,36.25 31.5,37.5 v31.5,43.62
MXB-BMA-09-H  (via drill 0.3)
  Top 0.152: v33.62,35.38 33.69,35.31 37.56,35.31 37.62,35.25 U2.35 | v33.48,47.48 31.25,49.7 13.8,49.7 v11.9,51.6
  Bottom 0.152: v33.62,35.38 33.48,35.52 v33.48,47.48 | v11.9,51.6 10.5,53 X2.9
MXB-BMA-10-H  (via drill 0.3)
  Top 0.152: v40.75,34.38 40.62,34.25 U2.33 | v40.75,43 40.75,44.4 40.4,44.75 18.73,44.75 v14.4,49.08
  Bottom 0.152: v40.75,43 v40.75,34.38 | v14.4,49.08 12.5,50.98 X2.11
MXB-BMA-11-H  (via drill 0.3)
  Top 0.152: v34.25,33.88 34.31,33.81 37.56,33.81 37.62,33.75 U2.32 | v34.25,47.88 32.1,50.02 17,50.02 v14.5,52.52
  Bottom 0.152: v34.25,47.88 v34.25,33.88 | X2.13 v14.5,52.52
MXB-MCBMB-00-H
  Top 0.152: X2.15 16.5,58.38 26.88,68.75 33.12,68.75 34.5,67.38 38.5,67.38 38.62,67.25 U1.47
MXB-MCBMB-01-H
  Top 0.152: X2.16 27.88,68.38 33,68.38 34.5,66.88 38.5,66.88 38.62,66.75 U1.46
MXB-MCBMB-02-H  (via drill 0.3)
  Top 0.152: v36.38,64.75 37,65.38 37.38,65.38 37.62,65.62 38.5,65.62 38.62,65.75 U1.44
  Bottom 0.152: v36.38,64.75 35.02,64.75 32.88,66.89 28.79,66.89 19.9,58 X2.18
MXB-MCBMB-03-H  (via drill 0.3)
  Top 0.152: U1.43 39.5,65.25 40.75,66.5 40.75,67.9 40.4,68.25 v34.88,68.25
  Bottom 0.152: v34.88,68.25 v34.88,68.26 30.14,73 6.5,73 X1.4
MXB-MCBMB-04-H  (via drill 0.3)
  Top 0.152: v40.43,64.78 39.9,64.25 U1.41 | v40.75,69.75 39.88,70.62 10.5,70.62 9.5,71.62 9.5,73 7.5,73 X1.5
  Bottom 0.152: v40.43,64.78 40.75,65.1 v40.75,69.75
MXB-MCBMB-05-H
  Top 0.152: U1.40 40.38,63.75 41.12,64.5 41.12,68.31 40.31,69.12 11.38,69.12 X1.7
MXB-MCBMB-06-H  (via drill 0.35)
  Top 0.152: U1.38 37.75,62.75 37.59,62.59 33.59,62.59 v33.5,62.5 | X3.9 10.76,40 12.51,41.75 12.51,42.27 13.94,43.7 v23.4,43.7
  Layer3 0.152: v25,57.8 v28,60.8
  Bottom 0.152: v23.4,43.7 25,45.3 v25,57.8 | v33.5,62.5 29.7,62.5 v28,60.8
MXB-MCBMB-07-H  (via drill 0.3)
  Top 0.152: U1.37 36.12,62.25 34,60.12 34,56.4 33.1,55.5 23.12,55.5 21.9,56.73 v21.83,56.73
  Bottom 0.152: v21.83,56.73 16.12,51.02 16.12,46 12.5,42.38 X3.11
MXB-MCBMB-08-H  (via drill 0.3)
  Top 0.152: U1.36 36.5,61.75 v36.25,61.5 | v34.88,42.38 21.25,42.38 19.88,41 15.5,41 X3.13
  Bottom 0.152: v36.25,61.5 34.88,60.12 v34.88,42.38
MXB-MCBMB-09-H  (via drill 0.3)
  Top 0.152: U1.35 36.88,61.25 34.38,58.75 34.38,56.3 33.2,55.12 22.5,55.12 21.85,55.77 v21.85,55.8
  Bottom 0.152: v21.85,55.8 16.5,50.45 X3.15
MXB-MCBMB-10-H  (via drill 0.3)
  Top 0.152: v40.12,60.12 40,60.25 U1.33 | v40.12,44.12 39,43 18.5,43 X3.16
  Bottom 0.152: v40.12,60.12 41,59.25 41,45 v40.12,44.12
MXB-MCBMB-11-H  (via drill 0.3)
  Top 0.152: U1.32 35.88,59.75 34.75,58.62 34.75,56.2 33.3,54.75 22,54.75 v21.88,54.88
  Bottom 0.152: v21.88,54.88 19.5,52.5 X3.18
MXB-MEM-TP3-H  (via drill 0.3)
  Top 0.152: v22.12,28 46.62,28 49.62,31 IC1.3
  Bottom 0.152: v22.12,28 20.62,26.5 20.62,11.12 X5.18
MXB-START-MEMORY-H  (via drill 0.3)
  Top 0.152: v42.45,31.62 43.75,32.92 49.65,32.92 IC1.1 | v39.75,23.75 39.25,23.25 33.12,23.25 31.88,22 20.88,22 v15.88,17
  Bottom 0.152: v42.45,31.62 39.75,28.93 v39.75,23.75 | v15.88,17 15.9,16.98 15.9,13.68 12.5,10.28 X5.11
MXF-EA-00-H
  Top 0.152: U2.30 39.5,32.75 41.5,30.75 41.5,29.82 40.44,28.75 16.38,28.75 5.5,39.62 X3.4
MXF-EA-01-H
  Top 0.152: U2.29 39.5,32.25 41.12,30.62 41.12,29.87 40.38,29.12 17.38,29.12 X3.5
MXF-EA-02-H
  Top 0.152: X3.7 19,29.5 40.32,29.5 40.71,29.88 40.71,30.37 39.82,31.25 U2.27
N$1  (via drill 0.35)
  Top 0.152: U3.36 v76.3,11 | v68.4,29.1 68.4,30.97 C1.1
  Bottom 0.152: v68.4,29.1 68.4,18.9 v76.3,11
N$2  (via drill 0.3)
  Top 0.152: U3.9 55.5,19 54.62,19.88 v45.25,19.88 33.6,19.88 v33.5,19.98 | v43.12,17.38 42,16.25 U4.47 | v29.88,61.62 31.12,61.62 31.25,61.75 U1.13
  Bottom 0.152: v43.12,17.38 43.12,17.55 45.25,19.68 v45.25,19.88 | v29.88,61.62 29.23,60.98 29.23,34.42 30.12,33.52 30.12,24.75 33.5,21.38 v33.5,19.98
N$3  (via drill 0.3)
  Top 0.152: v55.25,18.12 66.38,18.12 U3.10 | v44.35,16.48 43.75,15.88 39.88,15.88 39.75,15.75 U4.46 37.83,15.75 37.6,15.97 37.6,16.98 37.75,17.12 38.7,17.12 39.12,17.55 39.12,18.12 v38.62,18.62 | v33.38,61.38 31.5,61.38 31.38,61.25 U1.14
  Layer2 0.152: v55.25,18.12 52.62,18.12 52.12,17.62 46.1,17.62 44.95,16.48 v44.35,16.48
  Bottom 0.152: v33.38,61.38 34.38,61.38 35.5,62.5 36.73,62.5 38.62,60.61 v38.62,18.62
N$4  (via drill 0.3)
  Top 0.152: v46.25,15.75 46,15.5 40.25,15.5 40,15.25 | 40,15.25 39.5,14.75 U4.44 | v25.62,60.12 31.12,60.12 31.25,60.25 U1.16 | v25.62,18.62 26.25,18 38.25,18 v38.5,17.75 | 40,15.25 v40.12,15.25 | v58.05,17.18 58.27,17.4 U3.11
  Layer2 0.152: v58.05,17.18 55.12,14.25 47.75,14.25 v46.25,15.75
  Bottom 0.152: v25.62,18.62 v25.62,60.12 | v38.5,17.75 40.12,16.12 v40.12,15.25
N$5  (via drill 0.3)
  Top 0.152: U3.12 65.22,16.6 63.02,14.39 43.1,14.39 43.1,14.4 42.91,14.6 40.6,14.6 40.25,14.25 U4.43 37.38,14.25 36.62,15 v36.62,16.62 | v33.38,59.88 31.5,59.88 31.38,59.75 U1.17
  Bottom 0.152: v33.38,59.88 35.62,62.12 36.68,62.12 38,60.8 38,18.12 36.62,16.75 v36.62,16.62
N$6  (via drill 0.3)
  Top 0.152: v41.85,21.32 41.8,21.38 v22.75,21.38 | U4.41 39.85,13.25 40.61,14.01 v42.5,14.01 v42.51,14 63.2,14 63.4,14.2 U3.15 | U1.19 25.05,58.75 v25,58.8
  Bottom 0.152: v22.75,21.38 22.75,56.98 24.58,58.8 v25,58.8 | v41.85,21.32 42.5,20.68 v42.5,14.01
N$7  (via drill 0.3)
  Top 0.152: U3.16 66.45,13.4 66.42,13.43 40.52,13.43 39.85,12.75 U4.40 38.65,12.73 37.63,12.73 37.55,12.81 37.44,12.81 v37.12,13.12 | v33.38,58.38 32.5,58.38 32.38,58.25 U1.20 | v32.88,27.38 34.88,25.38 v35.12,25.38
  Bottom 0.152: v32.88,27.38 30.88,29.38 30.88,56.73 32.52,58.38 v33.38,58.38 | v35.12,25.38 35.38,25.12 35.38,14.88 v37.12,13.12
N$8
  Top 0.152: U3.43 78.1,16.6 79.24,17.75 79.24,37.38 R4.2
N$9
  Top 0.152: R1.2 78.33,27.19 78.33,19.23 78.1,19 U3.46
N$10
  Top 0.152: U3.45 78.1,18.2 78.64,18.74 78.64,30.59 R2.2
N$11  (via drill 0.3)
  Top 0.152: U3.17 40.34,12.6 39.5,11.75 U4.38 37.88,11.75 37.62,11.5 36.25,11.5 v35.62,12.12 | v29.88,57.12 31.12,57.12 31.25,57.25 U1.22
  Bottom 0.152: v29.88,57.12 29.88,35.52 30.5,34.9 30.5,24.88 34.12,21.25 34.12,13.62 v35.62,12.12
N$12
  Top 0.152: U3.44 78.07,17.4 78.94,18.27 78.94,33.98 R3.2
N$13  (via drill 0.3)
  Top 0.152: 44.95,11.85 40.1,11.85 39.5,11.25 U4.37 | U3.18 66.45,11.85 44.95,11.85 | v33.38,56.88 32.5,56.88 32.38,56.75 U1.23 | v34.23,51.5 34.23,51.4 42.25,43.38 v45.05,43.38 | 44.95,11.85 v44.95,11.88
  Bottom 0.152: v33.38,56.88 34.23,56.02 v34.23,51.5 | v45.05,43.38 45.88,42.55 45.88,16.25 44.95,15.32 v44.95,11.88
N$14  (via drill 0.3)
  Top 0.152: v67.62,11.75 77.5,11.75 U3.37 | v65.38,9.5 64.6,10.28 39.98,10.28 39.5,10.75 U4.36 35.37,10.75 35.25,10.62 v32.75,10.62 | v26.88,63.73 30.39,67.25 U1.2
  Layer2 0.152: v32.75,10.62 32.75,10.53 v27.83,5.6
  Bottom 0.152: v65.38,9.5 v67.62,11.75 | v26.88,63.73 26.25,63.1 26.25,7.17 v27.83,5.6
N$15  (via drill 0.3, 0.35)
  Top 0.152: v68.5,12.38 68.7,12.57 77.5,12.57 U3.38 | v65.38,8.62 64.41,9.6 v46.91,9.6 v46.9,9.6 40.15,9.6 39.5,10.25 U4.35 | v34.5,66.2 33.83,66.88 31.5,66.88 31.38,66.75 U1.3
  Bottom 0.152: v68.5,12.38 68.25,12.12 68.25,11.5 v65.38,8.62 | v34.5,66.2 38.65,70.35 42.5,70.35 46.9,65.95 v46.9,9.6
N$16  (via drill 0.3)
  Top 0.152: v67.62,13.38 77.5,13.38 U3.39 | v63.62,8.82 41.72,8.82 41.29,9.25 U4.33 | v29.88,65.62 31.12,65.62 31.25,65.75 U1.5
  Bottom 0.152: v67.62,13.38 63.62,9.38 v63.62,8.82 63.62,7.88 59.05,3.3 31,3.3 26.62,7.67 26.62,62.38 v29.88,65.62
N$17  (via drill 0.3)
  Top 0.152: v68.25,14 68.45,14.2 U3.40 | v62.95,8.18 41.45,8.18 v41,8.62 40.88,8.75 U4.32 | v35.73,65.38 31.5,65.38 31.38,65.25 U1.6
  Bottom 0.152: v41,8.62 41,17.12 39.12,19 39.12,63.73 37.53,65.33 35.77,65.33 v35.73,65.38 | v68.25,14 68.21,13.96 67.38,13.96 62.95,9.52 v62.95,8.18
N$30  (via drill 0.3)
  Top 0.152: v62.38,7.5 63.1,7.5 63.4,7.8 U3.23 | v55.88,24.48 54.48,25.88 v36.5,25.88 | v35.75,41.38 35.38,41 32.38,41 32.12,41.25 U2.2
  Bottom 0.152: v62.38,7.5 55.88,14 v55.88,24.48 | v36.5,25.88 35.75,26.62 v35.75,41.38
N$31  (via drill 0.3)
  Top 0.152: U3.5 42.8,22.2 42.38,22.62 v37.38,22.62 | v36.5,31.25 34.5,33.25 33.62,33.25 32.98,33.9 32.48,33.9 32.12,34.25 U2.16
  Bottom 0.152: v37.38,22.62 37.12,22.88 37.12,30 36.5,30.62 v36.5,31.25
N$32  (via drill 0.3)
  Top 0.152: U3.3 66.49,23.81 43.44,23.81 42.5,24.75 31.88,24.75 v29.25,27.38 | v28.88,31.65 28.78,31.65 27.25,33.17 27.25,33.8 29.2,35.75 U2.13
  Bottom 0.152: v29.25,27.38 28.88,27.75 v28.88,31.65
N$33  (via drill 0.3)
  Top 0.152: U3.4 43.75,23 42.38,24.38 31.38,24.38 v29.25,26.5 | v29.88,34.65 29.88,34.67 30.45,35.25 U2.14
  Layer2 0.152: v29.25,26.5 29.88,27.12 v29.88,34.65
N$34  (via drill 0.3)
  Top 0.152: v29.85,20.6 42.75,20.6 43.55,21.4 U3.6 | v28.8,33.48 29.08,33.75 U2.17
  Bottom 0.152: v29.85,20.6 28.25,22.2 28.25,32.92 v28.8,33.48
N$36  (via drill 0.3)
  Top 0.152: U3.7 67.07,20.59 67.38,20.9 67.38,25.7 65.95,27.12 v34,27.12 | v33.75,31.62 32.88,32.5 32.38,32.5 32.12,32.75 U2.19
  Bottom 0.152: v34,27.12 33.75,27.38 v33.75,31.62
N$37  (via drill 0.3)
  Top 0.152: U3.20 65.17,10.2 64.75,10.62 40.5,10.62 v40.12,11 | v36,15.12 33.75,17.38 v29.88,17.38 | v27.88,33.5 29.12,32.25 U2.20
  Bottom 0.152: v36,15.12 v40.12,11 | v29.88,17.38 27.88,19.38 v27.88,33.5
N$38  (via drill 0.3)
  Top 0.152: v67.62,9.62 67.42,9.43 66.5,9.43 U3.21 | v59.12,24.48 57.1,26.5 v35.12,26.5 | v35.12,31 32.38,31 32.12,31.25 U2.22
  Bottom 0.152: v67.62,9.62 69.12,11.12 69.12,14.47 v59.12,24.48 | v35.12,31 v35.12,26.5
N$39  (via drill 0.3)
  Top 0.152: v67.62,8.5 67.52,8.6 U3.22 | v64.5,6.78 62.35,4.62 v55.38,4.62 | v27.25,30.12 27.88,30.75 U2.23
  Bottom 0.152: v67.62,8.5 67.42,8.3 66,8.3 66,8.28 v64.5,6.78 | v55.38,4.62 30.12,4.62 27.25,7.5 v27.25,30.12
N$40  (via drill 0.3)
  Top 0.152: v65.38,6.75 65.38,6.8 65.57,7 U3.24 | v25,40.12 25.62,40.75 U2.3
  Bottom 0.152: v65.38,6.75 61.55,2.92 29.6,2.92 25,7.53 25,36.27 25.25,36.52 25.25,39.88 v25,40.12
N$41  (via drill 0.3)
  Top 0.152: U3.31 70.62,7 67.25,3.62 27.03,3.62 v26.83,3.83 | v23.38,38 24.88,39.5 30.25,39.5 30.5,39.75 U2.5
  Bottom 0.152: v26.83,3.83 23.38,7.28 v23.38,38
N$42  (via drill 0.3)
  Top 0.152: v76.38,7.75 77.5,7.75 U3.32 | U2.6 32.38,39.25 32.7,39.58 34.83,39.58 37.62,42.38 51.62,42.38 53.81,40.19 53.81,31.75 53.8,31.74 53.8,31.7 57.75,27.75 v66.25,27.75
  Bottom 0.152: v76.38,7.75 66.25,17.88 v66.25,27.75
N$43  (via drill 0.3)
  Top 0.152: v41.25,7.38 42.62,7.38 46,4 67.12,4 71.7,8.57 77.5,8.57 U3.33 | v34.88,36.38 33.25,38 32.38,38 32.12,38.25 U2.8
  Bottom 0.152: v41.25,7.38 34.5,14.12 34.5,26.75 34.62,26.88 34.62,30.62 34.5,30.75 34.5,33.25 34.88,33.62 v34.88,36.38
N$44  (via drill 0.3)
  Top 0.152: v67.62,6.5 70.5,9.38 77.5,9.38 U3.34 | v24,37.38 24.38,37.75 U2.9
  Bottom 0.152: v67.62,6.5 67.12,6.5 62.77,2.15 29.35,2.15 24,7.5 v24,37.38
N$45  (via drill 0.3)
  Top 0.152: v67.62,7.5 70.25,10.13 77.5,10.13 U3.35 | U2.11 v24.62,36.75
  Bottom 0.152: v67.62,7.5 62.65,2.52 29.5,2.52 24.62,7.4 v24.62,36.75
START-MEMORY  (via drill 0.3)
  Top 0.152: v48.88,63.75 47.75,63.75 47.62,63.88 DL1.1 | v51.38,41.75 51.38,33 51.88,33 IC1.6
  Bottom 0.152: v48.88,63.75 51.38,61.25 v51.38,41.75
TIMING-PULSE-3  (via drill 0.3)
  Top 0.152: v48.88,48.75 48.68,48.95 DL2.1 | IC1.4 51.5,31.05 50.75,31.8 v50.75,41.12
  Bottom 0.152: v48.88,48.75 50.75,46.88 v50.75,41.12
VCC  (via drill 0.35)
  Top 0.152: IC1.5 v53.2,32 | IC2.14 54.65,18.95 v54.7,18.9 | U3.13 v65.3,15.8 | U3.41 v75.6,15 | C3.1 v50.77,67.8 | v37.3,64.7 37.35,64.75 U1.42 | U1.31 37.45,59.25 v37.3,59.1 | U1.7 32.65,64.75 v32.7,64.7 | U1.18 32.65,59.25 v32.7,59.2 | v52.1,64 53.38,64 DL1.14 54.1,63.95 55.1,62.95 55.1,60.9 56.5,59.5 VR1.3 | DL2.14 52.15,48.95 v52.1,48.9 | U2.31 38.62,33.2 v37.3,33.2 | U2.7 32.65,38.75 v32.7,38.7 | U2.18 32.65,33.25 v32.7,33.2 | v37.3,38.7 37.35,38.75 U2.42
  pour Layer3: 0,77 0,0 80.4,0 80.4,77
WRITE-ENABLE  (via drill 0.3)
  Top 0.152: U3.49 77.5,21.43 73.45,21.43 66.47,28.4 v58.08,28.4 54.7,31.77 54.7,45.8 54.15,46.35 DL2.10 | v49.12,16.5 47.88,16.5 47.75,16.38 IC2.5
  Bottom 0.152: v49.12,16.5 50.62,18 50.62,20.95 v58.08,28.4